# EAGLE schematic front-panel-revD-DEB-board1 (EAGLE 5.11), part 1 of 2
DRAWN_BY: Alexios; PROJECT_NAME: CFT Mini-Computer; REVISION: Rev A; SHEET_DESCRIPTION: Front Panel Light Connections; SIMULATION_FILENAME: N/A; URL: http://www.bedroomlan.org/cft

## Sheet 1 of 11
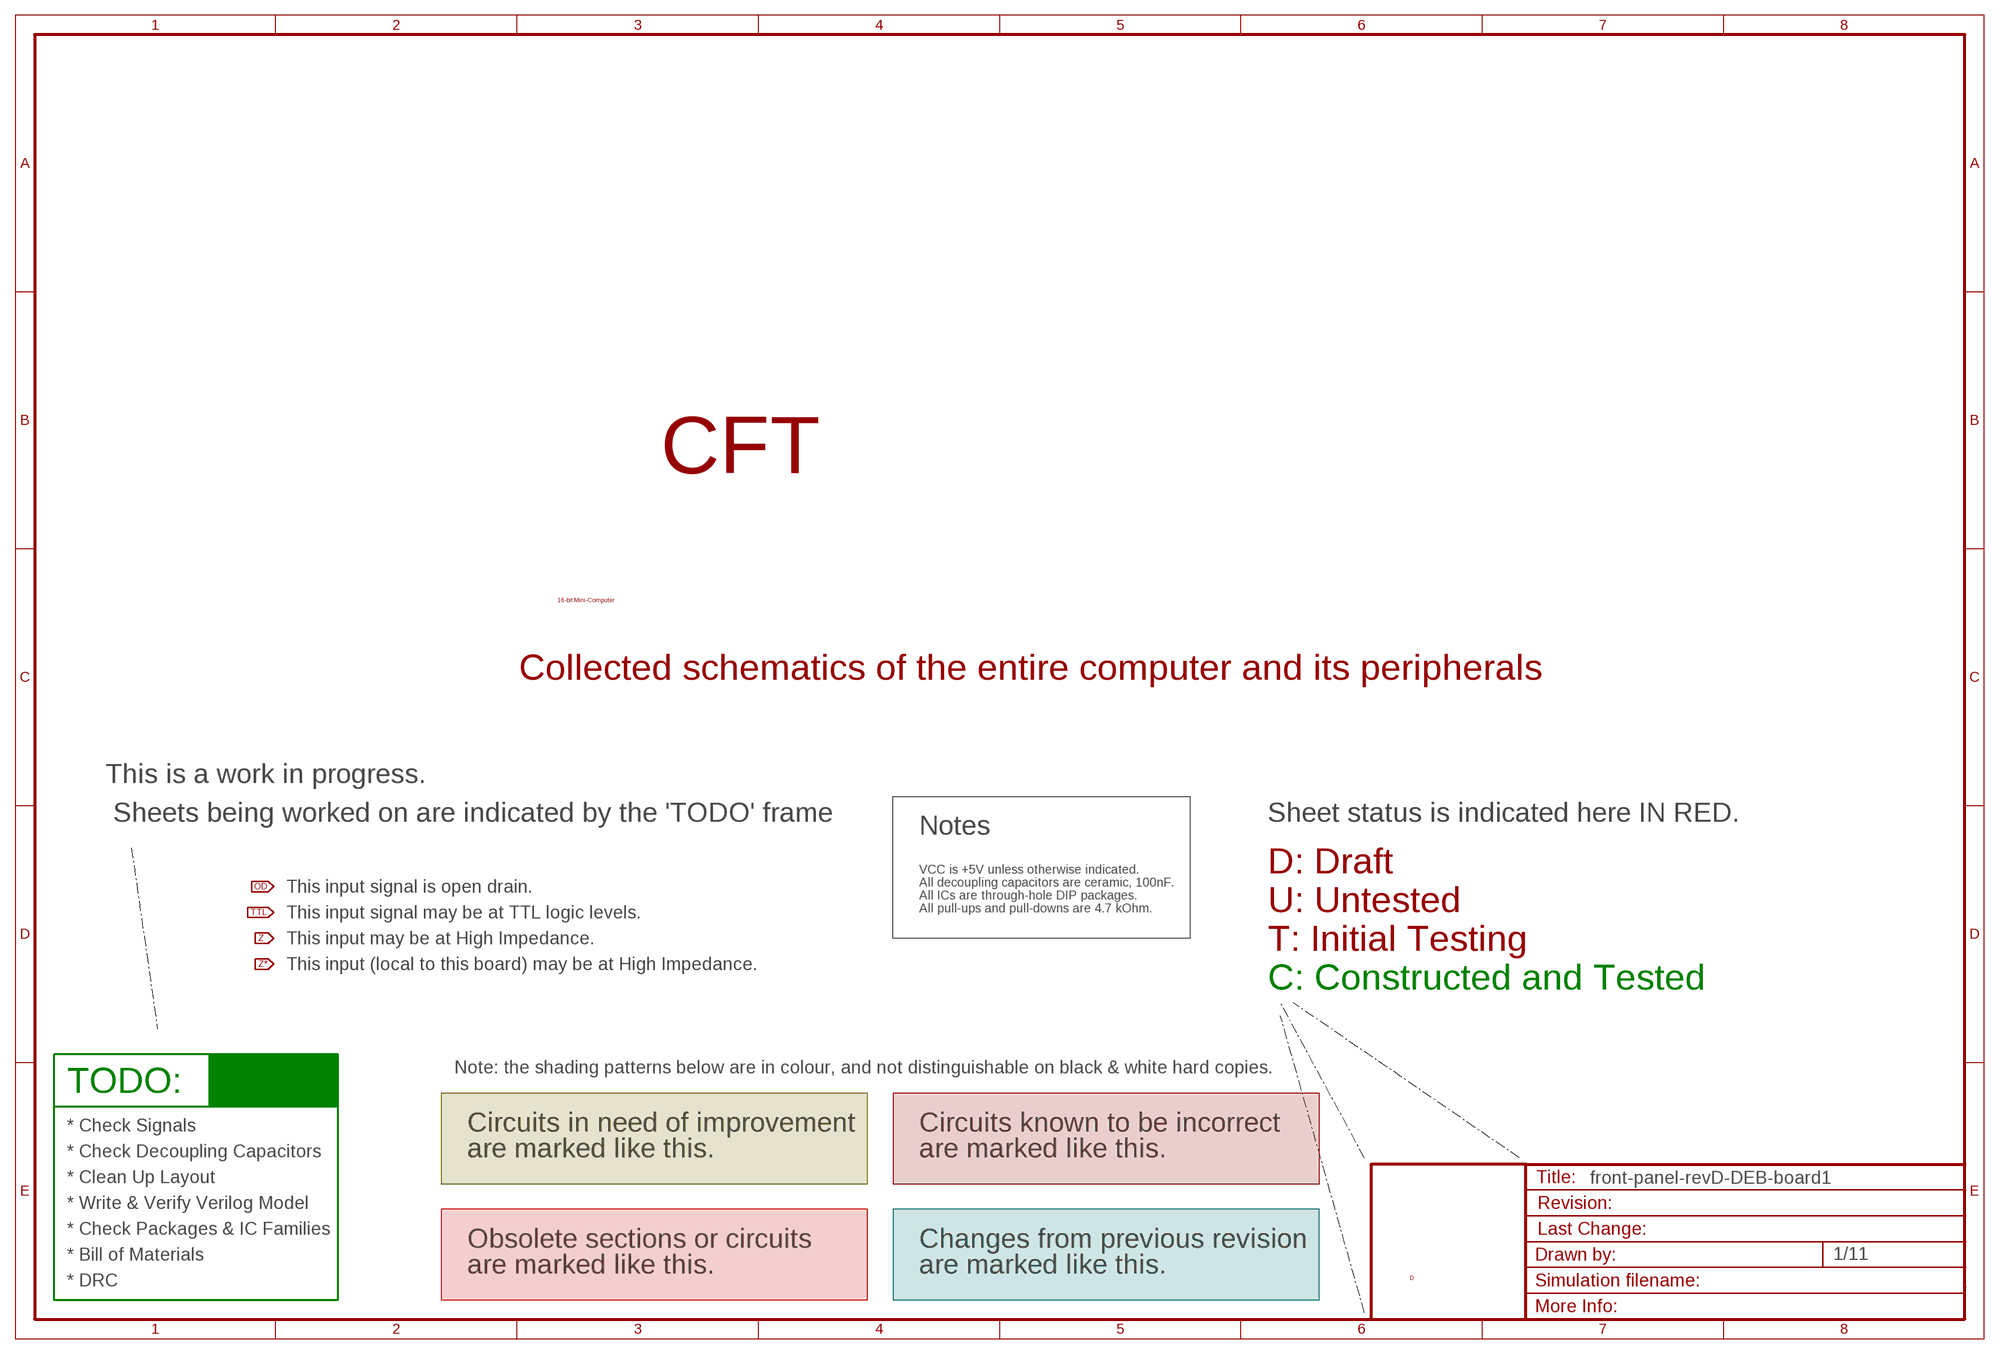
[diagram p0: schematic, sheet 1]

### Notes on the sheet
- CFT
- 16-bit Mini-Computer
- Collected schematics of the entire computer and its peripherals
- This is a work in progress.
- Sheets being worked on are indicated by the 'TODO' frame | Sheet status is indicated here IN RED.
- Notes
- VCC is +5V unless otherwise indicated. | D: Draft
- All decoupling capacitors are ceramic, 100nF.
- This input signal is open drain.
- All ICs are through-hole DIP packages.
- All pull-ups and pull-downs are 4.7 kOhm. | U: Untested
- This input signal may be at TTL logic levels.
- This input may be at High Impedance.
- T: Initial Testing
- This input (local to this board) may be at High Impedance.
- C: Constructed and Tested
- Note: the shading patterns below are in colour, and not distinguishable on black & white hard copies.
- TODO:
- * Check Signals | Circuits in need of improvement | Circuits known to be incorrect
- * Check Decoupling Capacitors | are marked like this. | are marked like this.
- * Clean Up Layout
- * Write & Verify Verilog Model
- * Check Packages & IC Families
- Obsolete sections or circuits | Changes from previous revision
- * Bill of Materials
- are marked like this. | are marked like this.
- D
- * DRC

## Sheet 2 of 11
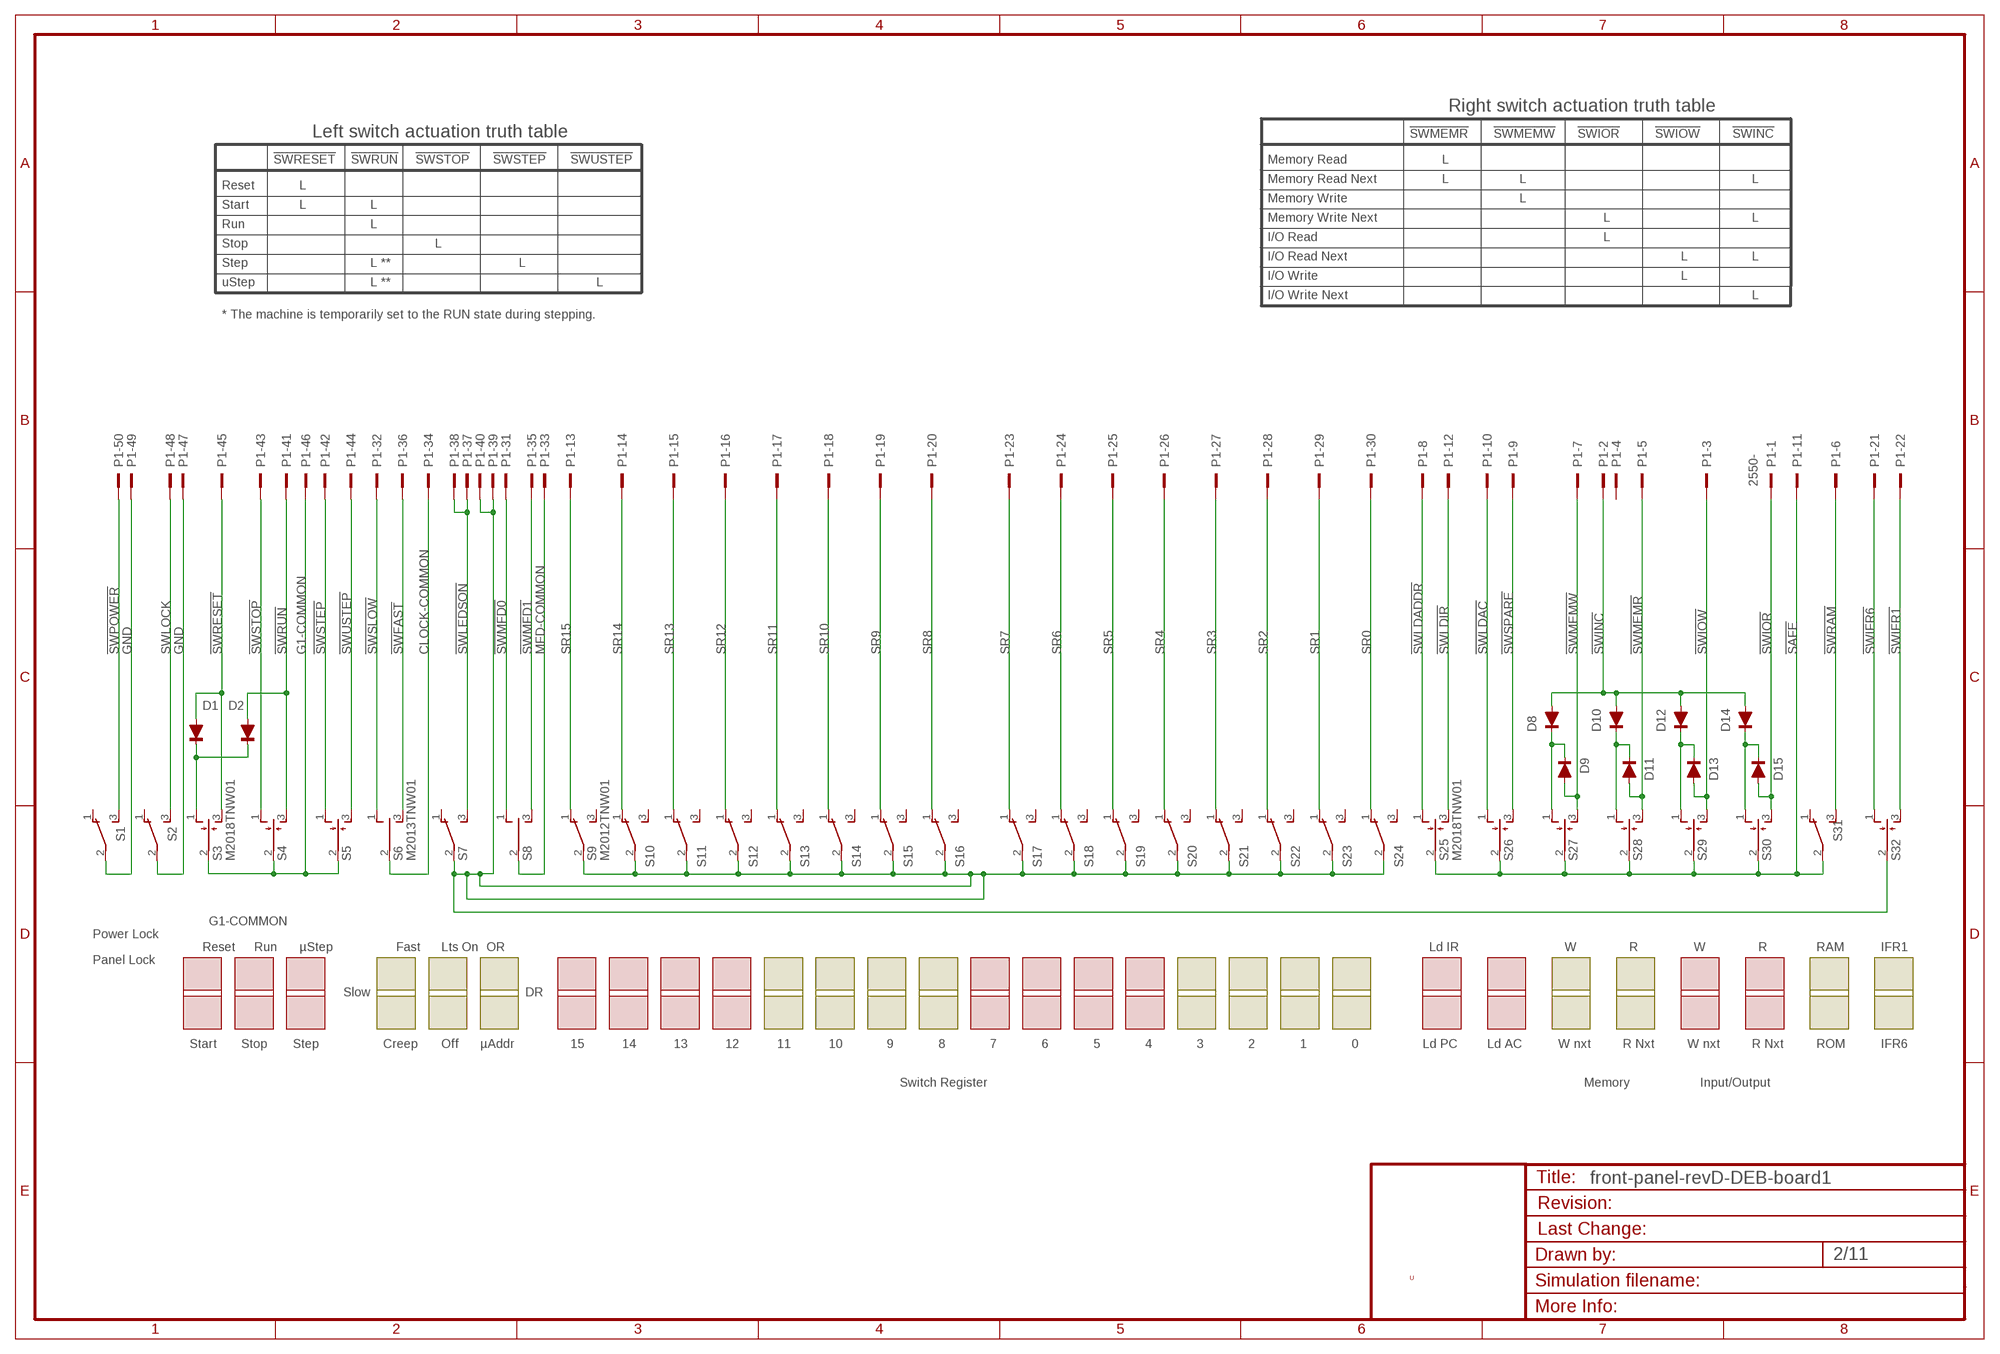
[diagram p1: schematic, sheet 2]

### Parts
D1  1N4148  1N4148DO35-7  [DO35-7]
D2  1N4148  1N4148DO35-7  [DO35-7]
D8  1N4148  1N4148DO35-7  [DO35-7]
D9  1N4148  1N4148DO35-7  [DO35-7]
D10  1N4148  1N4148DO35-7  [DO35-7]
D11  1N4148  1N4148DO35-7  [DO35-7]
D12  1N4148  1N4148DO35-7  [DO35-7]
D13  1N4148  1N4148DO35-7  [DO35-7]
D14  1N4148  1N4148DO35-7  [DO35-7]
D15  1N4148  1N4148DO35-7  [DO35-7]
P1  2550-  [PAK100/2500-50]
S1  TL36PO  [TL3XPO]
S2  TL36PO  [TL3XPO]
S3  M2018TNW01  TL37PO  [TL3XPO]
S4  TL37PO  [TL3XPO]
S5  TL37PO  [TL3XPO]
S6  M2013TNW01  TL39PO  [TL3XPO]
S7  TL36PO  [TL3XPO]
S8  TL39PO  [TL3XPO]
S9  M2012TNW01  TL36PO  [TL3XPO]
S10  TL36PO  [TL3XPO]
S11  TL36PO  [TL3XPO]
S12  TL36PO  [TL3XPO]
S13  TL36PO  [TL3XPO]
S14  TL36PO  [TL3XPO]
S15  TL36PO  [TL3XPO]
S16  TL36PO  [TL3XPO]
S17  TL36PO  [TL3XPO]
S18  TL36PO  [TL3XPO]
S19  TL36PO  [TL3XPO]
S20  TL36PO  [TL3XPO]
S21  TL36PO  [TL3XPO]
S22  TL36PO  [TL3XPO]
S23  TL36PO  [TL3XPO]
S24  TL36PO  [TL3XPO]
S25  M2018TNW01  TL37PO  [TL3XPO]
S26  TL37PO  [TL3XPO]
S27  TL37PO  [TL3XPO]
S28  TL37PO  [TL3XPO]
S29  TL37PO  [TL3XPO]
S30  TL37PO  [TL3XPO]
S31  TL36PO  [TL3XPO]
S32  TL37PO  [TL3XPO]

### Nets
!SAFE: P1.11 S25.2(P) S26.2(P) S27.2(P) S28.2(P) S29.2(P) S30.2(P) S31.2(P) ; also sheet 6
!SREN [low power]: P1.39 P1.40 S7.2(P) S9.2(P) S10.2(P) S11.2(P) S12.2(P) S13.2(P) S14.2(P) S15.2(P) S16.2(P) S17.2(P) S18.2(P) S19.2(P) S20.2(P) S21.2(P) S22.2(P) S23.2(P) S24.2(P) S32.2(P)
!SWFAST: P1.36 S6.3(S) ; also sheet 4,10
!SWIFR1: P1.22 S32.3(S) ; also sheet 4,10
!SWIFR6: P1.21 S32.1(O) ; also sheet 4,10
!SWINC: D8.A D10.A D12.A D14.A P1.2 ; also sheet 4,10
!SWIOR: D15.A P1.1 S30.3(S) ; also sheet 4,10
!SWIOW: D13.A P1.3 S29.3(S) ; also sheet 4,10
!SWLDAC: P1.10 S26.1(O) ; also sheet 4,10
!SWLDADDR: P1.8 S25.1(O) ; also sheet 4,10
!SWLDIR: P1.12 S25.3(S) ; also sheet 4,10
!SWLEDSON: P1.37 P1.38 S7.3(S) ; also sheet 9,10
!SWMEMR: D11.A P1.5 S28.3(S) ; also sheet 4,10
!SWMEMW: D9.A P1.7 S27.3(S) ; also sheet 4,10
!SWMFD0: P1.31 S8.1(O) ; also sheet 3,10
!SWMFD1: P1.35 S8.3(S) ; also sheet 3,10
!SWPOWER: P1.50 S1.3(S) ; also sheet 10
!SWRAM: P1.6 S31.3(S) ; also sheet 4,10
!SWRESET: D1.A P1.45 S3.3(S) ; also sheet 4,10
!SWRUN: D2.A P1.41 S4.3(S) ; also sheet 4,10
!SWSLOW: P1.32 S6.1(O) ; also sheet 4,10
!SWSPARE: P1.9 S26.3(S) ; also sheet 4,10
!SWSTEP: P1.42 S5.1(O) ; also sheet 4,10
!SWSTOP: P1.43 S4.1(O) ; also sheet 4,10
!SWUSTEP: P1.44 S5.3(S) ; also sheet 4,10
CLOCK-COMMON: P1.34 S6.2(P)
G1-COMMON: P1.46 S3.2(P) S4.2(P) S5.2(P)
GND [low power]: P1.47 P1.49 S1.2(P) S2.2(P) ; also sheet 3,4,5,6,7,8,9,10,11
MFD-COMMON [low power]: P1.33 S8.2(P)
N$64: D1.C D2.C S3.1(O)
N$84: D8.C D9.C S27.1(O)
N$88: D10.C D11.C S28.1(O)
N$90: D12.C D13.C S29.1(O)
N$92: D14.C D15.C S30.1(O)
SR0: P1.30 S24.1(O) ; also sheet 4,10
SR1: P1.29 S23.1(O) ; also sheet 4,10
SR2: P1.28 S22.1(O) ; also sheet 4,10
SR3: P1.27 S21.1(O) ; also sheet 4,10
SR4: P1.26 S20.1(O) ; also sheet 4,10
SR5: P1.25 S19.1(O) ; also sheet 4,10
SR6: P1.24 S18.1(O) ; also sheet 4,10
SR7: P1.23 S17.1(O) ; also sheet 4,10
SR8: P1.20 S16.1(O) ; also sheet 4,10
SR9: P1.19 S15.1(O) ; also sheet 4,10
SR10: P1.18 S14.1(O) ; also sheet 4,10
SR11: P1.17 S13.1(O) ; also sheet 4,10
SR12: P1.16 S12.1(O) ; also sheet 4,10
SR13: P1.15 S11.1(O) ; also sheet 4,10
SR14: P1.14 S10.1(O) ; also sheet 4,10
SR15: P1.13 S9.1(O) ; also sheet 4,10
SWLOCK: P1.48 S2.3(S) ; also sheet 4,10
Unconnected: P1.4 S1.1(O) S2.1(O) S7.1(O) S9.3(S) S10.3(S) S11.3(S) S12.3(S) S13.3(S) S14.3(S) S15.3(S) S16.3(S) S17.3(S) S18.3(S) S19.3(S) S20.3(S) S21.3(S) S22.3(S) S23.3(S) S24.3(S) S31.1(O)

### Notes on the sheet
- Right switch actuation truth table
- Left switch actuation truth table | !SWMEMR | !SWMEMW | !SWIOR | !SWIOW | !SWINC
- !SWRESET | !SWRUN | !SWSTOP | !SWSTEP | !SWUSTEP | Memory Read | L
- Memory Read Next | L | L | L
- Reset | L
- Memory Write | L
- Start | L | L
- Memory Write Next | L | L
- Run | L
- I/O Read | L
- Stop | L
- I/O Read Next | L | L
- Step | L ** | L
- I/O Write | L
- uStep | L ** | L
- I/O Write Next | L
- * The machine is temporarily set to the RUN state during stepping.
- Power Lock
- Reset | Run | µStep | Fast | Lts On | OR | Ld IR | W | R | W | R | RAM | IFR1
- Panel Lock
- Slow | DR
- Start | Stop | Step | Creep | Off | µAddr | 15 | 14 | 13 | 12 | 11 | 10 | 9 | 8 | 7 | 6 | 5 | 4 | 3 | 2 | 1 | 0 | Ld PC | Ld AC | W nxt | R Nxt | W nxt | R Nxt | ROM | IFR6
- Switch Register | Memory | Input/Output
- U

## Sheet 3 of 11
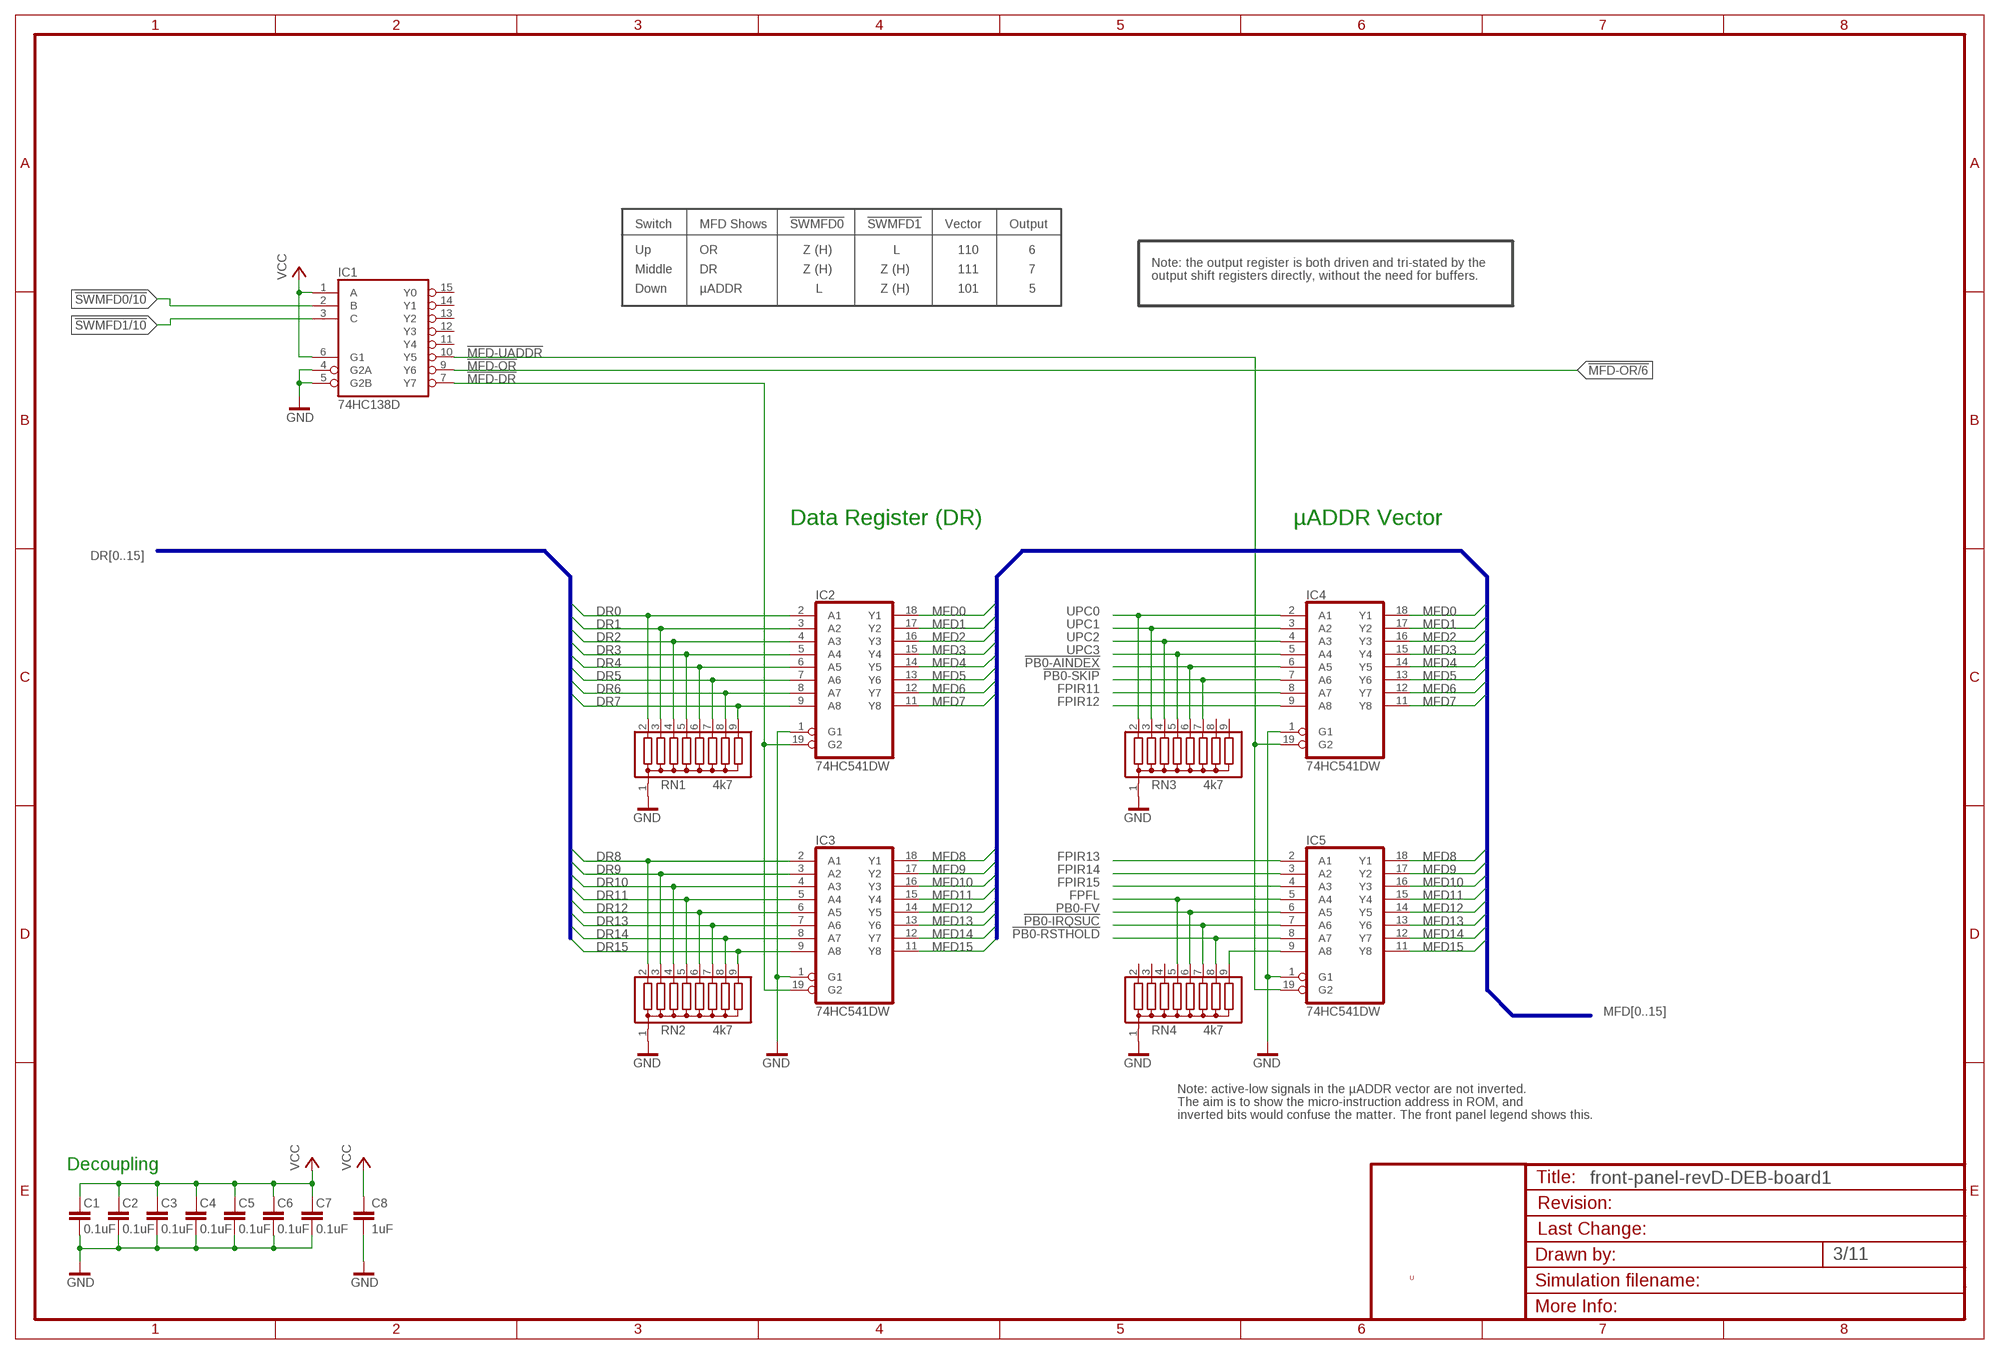
[diagram p2: schematic, sheet 3]

### Parts
C1  0.1uF  C-EU025-024X044  [C025-024X044]
C2  0.1uF  C-EU025-024X044  [C025-024X044]
C3  0.1uF  C-EU025-024X044  [C025-024X044]
C4  0.1uF  C-EU025-024X044  [C025-024X044]
C5  0.1uF  C-EU025-024X044  [C025-024X044]
C6  0.1uF  C-EU025-024X044  [C025-024X044]
C7  0.1uF  C-EU025-024X044  [C025-024X044]
C8  1uF  C-EU025-024X044  [C025-024X044]
IC1  74HC138D  [SO16]
IC2  74HC541DW  [SO20W]
IC3  74HC541DW  [SO20W]
IC4  74HC541DW  [SO20W]
IC5  74HC541DW  [SO20W]
RN1  4k7  G08R  [SIL9]
RN2  4k7  G08R  [SIL9]
RN3  4k7  G08R  [SIL9]
RN4  4k7  G08R  [SIL9]

### Nets
!MFD-DR: IC1.7(Y7) IC2.19(G2) IC3.19(G2)
!MFD-OR: IC1.9(Y6) ; also sheet 6
!MFD-UADDR: IC1.10(Y5) IC4.19(G2) IC5.19(G2)
!PB0-AINDEX: IC4.6(A5) RN3.6 ; also sheet 10
!PB0-IRQSUC: IC5.7(A6) RN4.7 ; also sheet 10
!PB0-RSTHOLD: IC5.8(A7) RN4.8 ; also sheet 10
!PB0-SKIP: IC4.7(A6) RN3.7 ; also sheet 10
!SWMFD0: IC1.2(B) ; also sheet 2,10
!SWMFD1: IC1.3(C) ; also sheet 2,10
DR0: IC2.2(A1) RN1.2 ; also sheet 10
DR1: IC2.3(A2) RN1.3 ; also sheet 10
DR2: IC2.4(A3) RN1.4 ; also sheet 10
DR3: IC2.5(A4) RN1.5 ; also sheet 10
DR4: IC2.6(A5) RN1.6 ; also sheet 10
DR5: IC2.7(A6) RN1.7 ; also sheet 10
DR6: IC2.8(A7) RN1.8 ; also sheet 10
DR7: IC2.9(A8) RN1.9 ; also sheet 10
DR8: IC3.2(A1) RN2.2 ; also sheet 10
DR9: IC3.3(A2) RN2.3 ; also sheet 10
DR10: IC3.4(A3) RN2.4 ; also sheet 10
DR11: IC3.5(A4) RN2.5 ; also sheet 10
DR12: IC3.6(A5) RN2.6 ; also sheet 10
DR13: IC3.7(A6) RN2.7 ; also sheet 10
DR14: IC3.8(A7) RN2.8 ; also sheet 10
DR15: IC3.9(A8) RN2.9 ; also sheet 10
FPFL: IC5.5(A4) RN4.5 ; also sheet 5,9,11
FPIR11: IC4.8(A7) ; also sheet 5,9,10
FPIR12: IC4.9(A8) ; also sheet 5,9,10
FPIR13: IC5.2(A1) ; also sheet 5,9,10
FPIR14: IC5.3(A2) ; also sheet 5,9,10
FPIR15: IC5.4(A3) ; also sheet 5,9,10
GND [low power]: C1.1 C2.1 C3.1 C4.1 C5.1 C6.1 C7.1 C8.2 IC1.4(G2A) IC1.5(G2B) IC2.1(G1) IC3.1(G1) IC4.1(G1) IC5.1(G1) RN1.1 RN2.1 RN3.1 RN4.1 ; also sheet 2,4,5,6,7,8,9,10,11
MFD0: IC2.18(Y1) IC4.18(Y1) ; also sheet 6,9
MFD1: IC2.17(Y2) IC4.17(Y2) ; also sheet 6,9
MFD2: IC2.16(Y3) IC4.16(Y3) ; also sheet 6,9
MFD3: IC2.15(Y4) IC4.15(Y4) ; also sheet 6,9
MFD4: IC2.14(Y5) IC4.14(Y5) ; also sheet 6,9
MFD5: IC2.13(Y6) IC4.13(Y6) ; also sheet 6,9
MFD6: IC2.12(Y7) IC4.12(Y7) ; also sheet 6,9
MFD7: IC2.11(Y8) IC4.11(Y8) ; also sheet 6,9
MFD8: IC3.18(Y1) IC5.18(Y1) ; also sheet 6,9
MFD9: IC3.17(Y2) IC5.17(Y2) ; also sheet 6,9
MFD10: IC3.16(Y3) IC5.16(Y3) ; also sheet 6,9
MFD11: IC3.15(Y4) IC5.15(Y4) ; also sheet 6,9
MFD12: IC3.14(Y5) IC5.14(Y5) ; also sheet 6,9
MFD13: IC3.13(Y6) IC5.13(Y6) ; also sheet 6,9
MFD14: IC3.12(Y7) IC5.12(Y7) ; also sheet 6,9
MFD15: IC3.11(Y8) IC5.11(Y8) ; also sheet 6,9
N$24 [low power]: IC5.9(A8) RN4.9
PB0-FV: IC5.6(A5) RN4.6 ; also sheet 5,9,10
UPC0: IC4.2(A1) RN3.2 ; also sheet 7,10
UPC1: IC4.3(A2) RN3.3 ; also sheet 7,10
UPC2: IC4.4(A3) RN3.4 ; also sheet 7,10
UPC3: IC4.5(A4) RN3.5 ; also sheet 7,10
VCC [low power]: C1.2 C2.2 C3.2 C4.2 C5.2 C6.2 C7.2 C8.1 IC1.1(A) IC1.6(G1) ; also sheet 4,5,6,7,8,10,11
Unconnected: IC1.11(Y4) IC1.12(Y3) IC1.13(Y2) IC1.14(Y1) IC1.15(Y0) RN3.8 RN3.9 RN4.2 RN4.3 RN4.4

### Buses
MFD[0..15]
DR[0..15]

### Notes on the sheet
- Switch | MFD Shows | !SWMFD0 | !SWMFD1 | Vector | Output
- Up | OR | Z (H) | L | 110 | 6
- Note: the output register is both driven and tri-stated by the
- Middle | DR | Z (H) | Z (H) | 111 | 7
- output shift registers directly, without the need for buffers.
- Down | µADDR | L | Z (H) | 101 | 5
- Data Register (DR) | µADDR Vector
- Note: active-low signals in the µADDR vector are not inverted.
- The aim is to show the micro-instruction address in ROM, and
- inverted bits would confuse the matter. The front panel legend shows this.
- Decoupling
- U

## Sheet 4 of 11
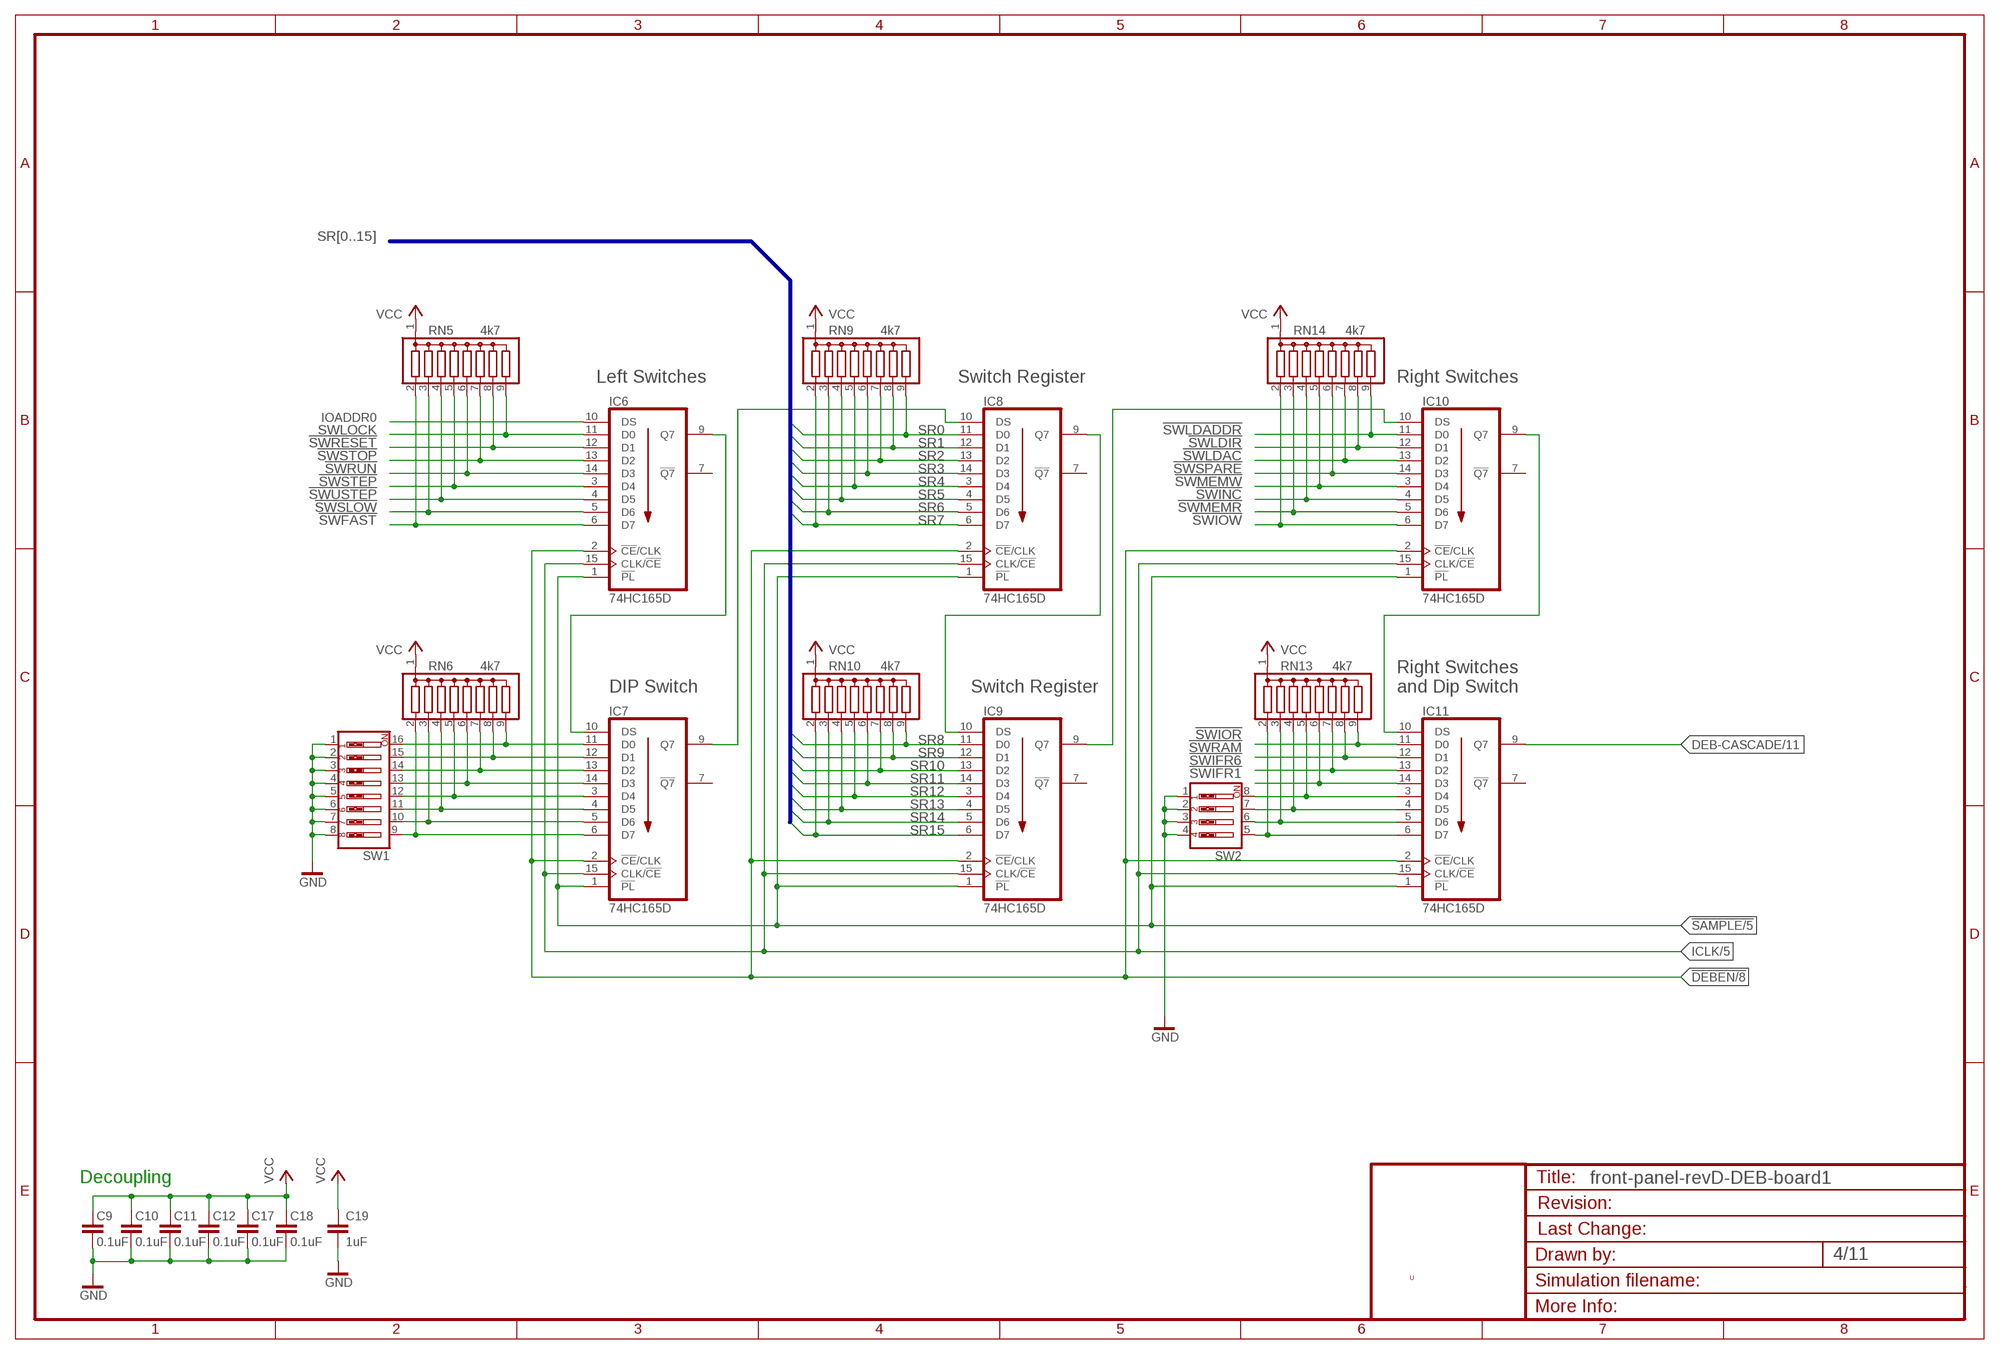
[diagram p3: schematic, sheet 4]

### Parts
C9  0.1uF  C-EU025-024X044  [C025-024X044]
C10  0.1uF  C-EU025-024X044  [C025-024X044]
C11  0.1uF  C-EU025-024X044  [C025-024X044]
C12  0.1uF  C-EU025-024X044  [C025-024X044]
C17  0.1uF  C-EU025-024X044  [C025-024X044]
C18  0.1uF  C-EU025-024X044  [C025-024X044]
C19  1uF  C-EU025-024X044  [C025-024X044]
IC6  74HC165D  [SO16]
IC7  74HC165D  [SO16]
IC8  74HC165D  [SO16]
IC9  74HC165D  [SO16]
IC10  74HC165D  [SO16]
IC11  74HC165D  [SO16]
RN5  4k7  G08R  [SIL9]
RN6  4k7  G08R  [SIL9]
RN9  4k7  G08R  [SIL9]
RN10  4k7  G08R  [SIL9]
RN13  4k7  G08R  [SIL9]
RN14  4k7  G08R  [SIL9]
SW1  SW_DIP-8  [EDG-08]
SW2  SW_DIP-4  [EDG-04]

### Nets
!DEBEN: IC6.2(!CE!/CLK) IC7.2(!CE!/CLK) IC8.2(!CE!/CLK) IC9.2(!CE!/CLK) IC10.2(!CE!/CLK) IC11.2(!CE!/CLK) ; also sheet 8,11
!SAMPLE: IC6.1(!PL) IC7.1(!PL) IC8.1(!PL) IC9.1(!PL) IC10.1(!PL) IC11.1(!PL) ; also sheet 5,8,11
!SWFAST: IC6.6(D7) RN5.2 ; also sheet 2,10
!SWIFR1: IC11.14(D3) RN13.6 ; also sheet 2,10
!SWIFR6: IC11.13(D2) RN13.7 ; also sheet 2,10
!SWINC: IC10.4(D5) RN14.4 ; also sheet 2,10
!SWIOR: IC11.11(D0) RN13.9 ; also sheet 2,10
!SWIOW: IC10.6(D7) RN14.2 ; also sheet 2,10
!SWLDAC: IC10.13(D2) RN14.7 ; also sheet 2,10
!SWLDADDR: IC10.11(D0) RN14.9 ; also sheet 2,10
!SWLDIR: IC10.12(D1) RN14.8 ; also sheet 2,10
!SWMEMR: IC10.5(D6) RN14.3 ; also sheet 2,10
!SWMEMW: IC10.3(D4) RN14.5 ; also sheet 2,10
!SWRAM: IC11.12(D1) RN13.8 ; also sheet 2,10
!SWRESET: IC6.12(D1) RN5.8 ; also sheet 2,10
!SWRUN: IC6.14(D3) RN5.6 ; also sheet 2,10
!SWSLOW: IC6.5(D6) RN5.3 ; also sheet 2,10
!SWSPARE: IC10.14(D3) RN14.6 ; also sheet 2,10
!SWSTEP: IC6.3(D4) RN5.5 ; also sheet 2,10
!SWSTOP: IC6.13(D2) RN5.7 ; also sheet 2,10
!SWUSTEP: IC6.4(D5) RN5.4 ; also sheet 2,10
DEB-CASCADE: IC11.9(Q7) ; also sheet 11
GND [low power]: C9.1 C10.1 C11.1 C12.1 C17.1 C18.1 C19.2 SW1.1 SW1.2 SW1.3 SW1.4 SW1.5 SW1.6 SW1.7 SW1.8 SW2.1 SW2.2 SW2.3 SW2.4 ; also sheet 2,3,5,6,7,8,9,10,11
ICLK: IC6.15(CLK/!CE!) IC7.15(CLK/!CE!) IC8.15(CLK/!CE!) IC9.15(CLK/!CE!) IC10.15(CLK/!CE!) IC11.15(CLK/!CE!) ; also sheet 5,8,11
IOADDR0: IC6.10(DS) ; also sheet 5,8,11
N$16: IC6.9(Q7) IC7.10(DS)
N$42: IC7.9(Q7) IC8.10(DS)
N$44: IC8.9(Q7) IC9.10(DS)
N$45: IC9.9(Q7) IC10.10(DS)
N$75: IC10.9(Q7) IC11.10(DS)
N$83: IC11.3(D4) RN13.5 SW2.8
N$86: IC11.4(D5) RN13.4 SW2.7
N$89: IC11.5(D6) RN13.3 SW2.6
N$91: IC11.6(D7) RN13.2 SW2.5
N$145: IC7.6(D7) RN6.2 SW1.9
N$146: IC7.5(D6) RN6.3 SW1.10
N$148: IC7.4(D5) RN6.4 SW1.11
N$149: IC7.3(D4) RN6.5 SW1.12
N$150: IC7.14(D3) RN6.6 SW1.13
N$151: IC7.13(D2) RN6.7 SW1.14
N$152: IC7.12(D1) RN6.8 SW1.15
N$153: IC7.11(D0) RN6.9 SW1.16
SR0: IC8.11(D0) RN9.9 ; also sheet 2,10
SR1: IC8.12(D1) RN9.8 ; also sheet 2,10
SR2: IC8.13(D2) RN9.7 ; also sheet 2,10
SR3: IC8.14(D3) RN9.6 ; also sheet 2,10
SR4: IC8.3(D4) RN9.5 ; also sheet 2,10
SR5: IC8.4(D5) RN9.4 ; also sheet 2,10
SR6: IC8.5(D6) RN9.3 ; also sheet 2,10
SR7: IC8.6(D7) RN9.2 ; also sheet 2,10
SR8: IC9.11(D0) RN10.9 ; also sheet 2,10
SR9: IC9.12(D1) RN10.8 ; also sheet 2,10
SR10: IC9.13(D2) RN10.7 ; also sheet 2,10
SR11: IC9.14(D3) RN10.6 ; also sheet 2,10
SR12: IC9.3(D4) RN10.5 ; also sheet 2,10
SR13: IC9.4(D5) RN10.4 ; also sheet 2,10
SR14: IC9.5(D6) RN10.3 ; also sheet 2,10
SR15: IC9.6(D7) RN10.2 ; also sheet 2,10
SWLOCK: IC6.11(D0) RN5.9 ; also sheet 2,10
VCC [low power]: C9.2 C10.2 C11.2 C12.2 C17.2 C18.2 C19.1 RN5.1 RN6.1 RN9.1 RN10.1 RN13.1 RN14.1 ; also sheet 3,5,6,7,8,10,11
Unconnected: IC6.7(!Q7) IC7.7(!Q7) IC8.7(!Q7) IC9.7(!Q7) IC10.7(!Q7) IC11.7(!Q7)

### Buses
SR[0..15]

### Notes on the sheet
- Left Switches | Switch Register | Right Switches
- Right Switches
- DIP Switch | Switch Register | and Dip Switch
- Decoupling
- U

## Sheet 5 of 11
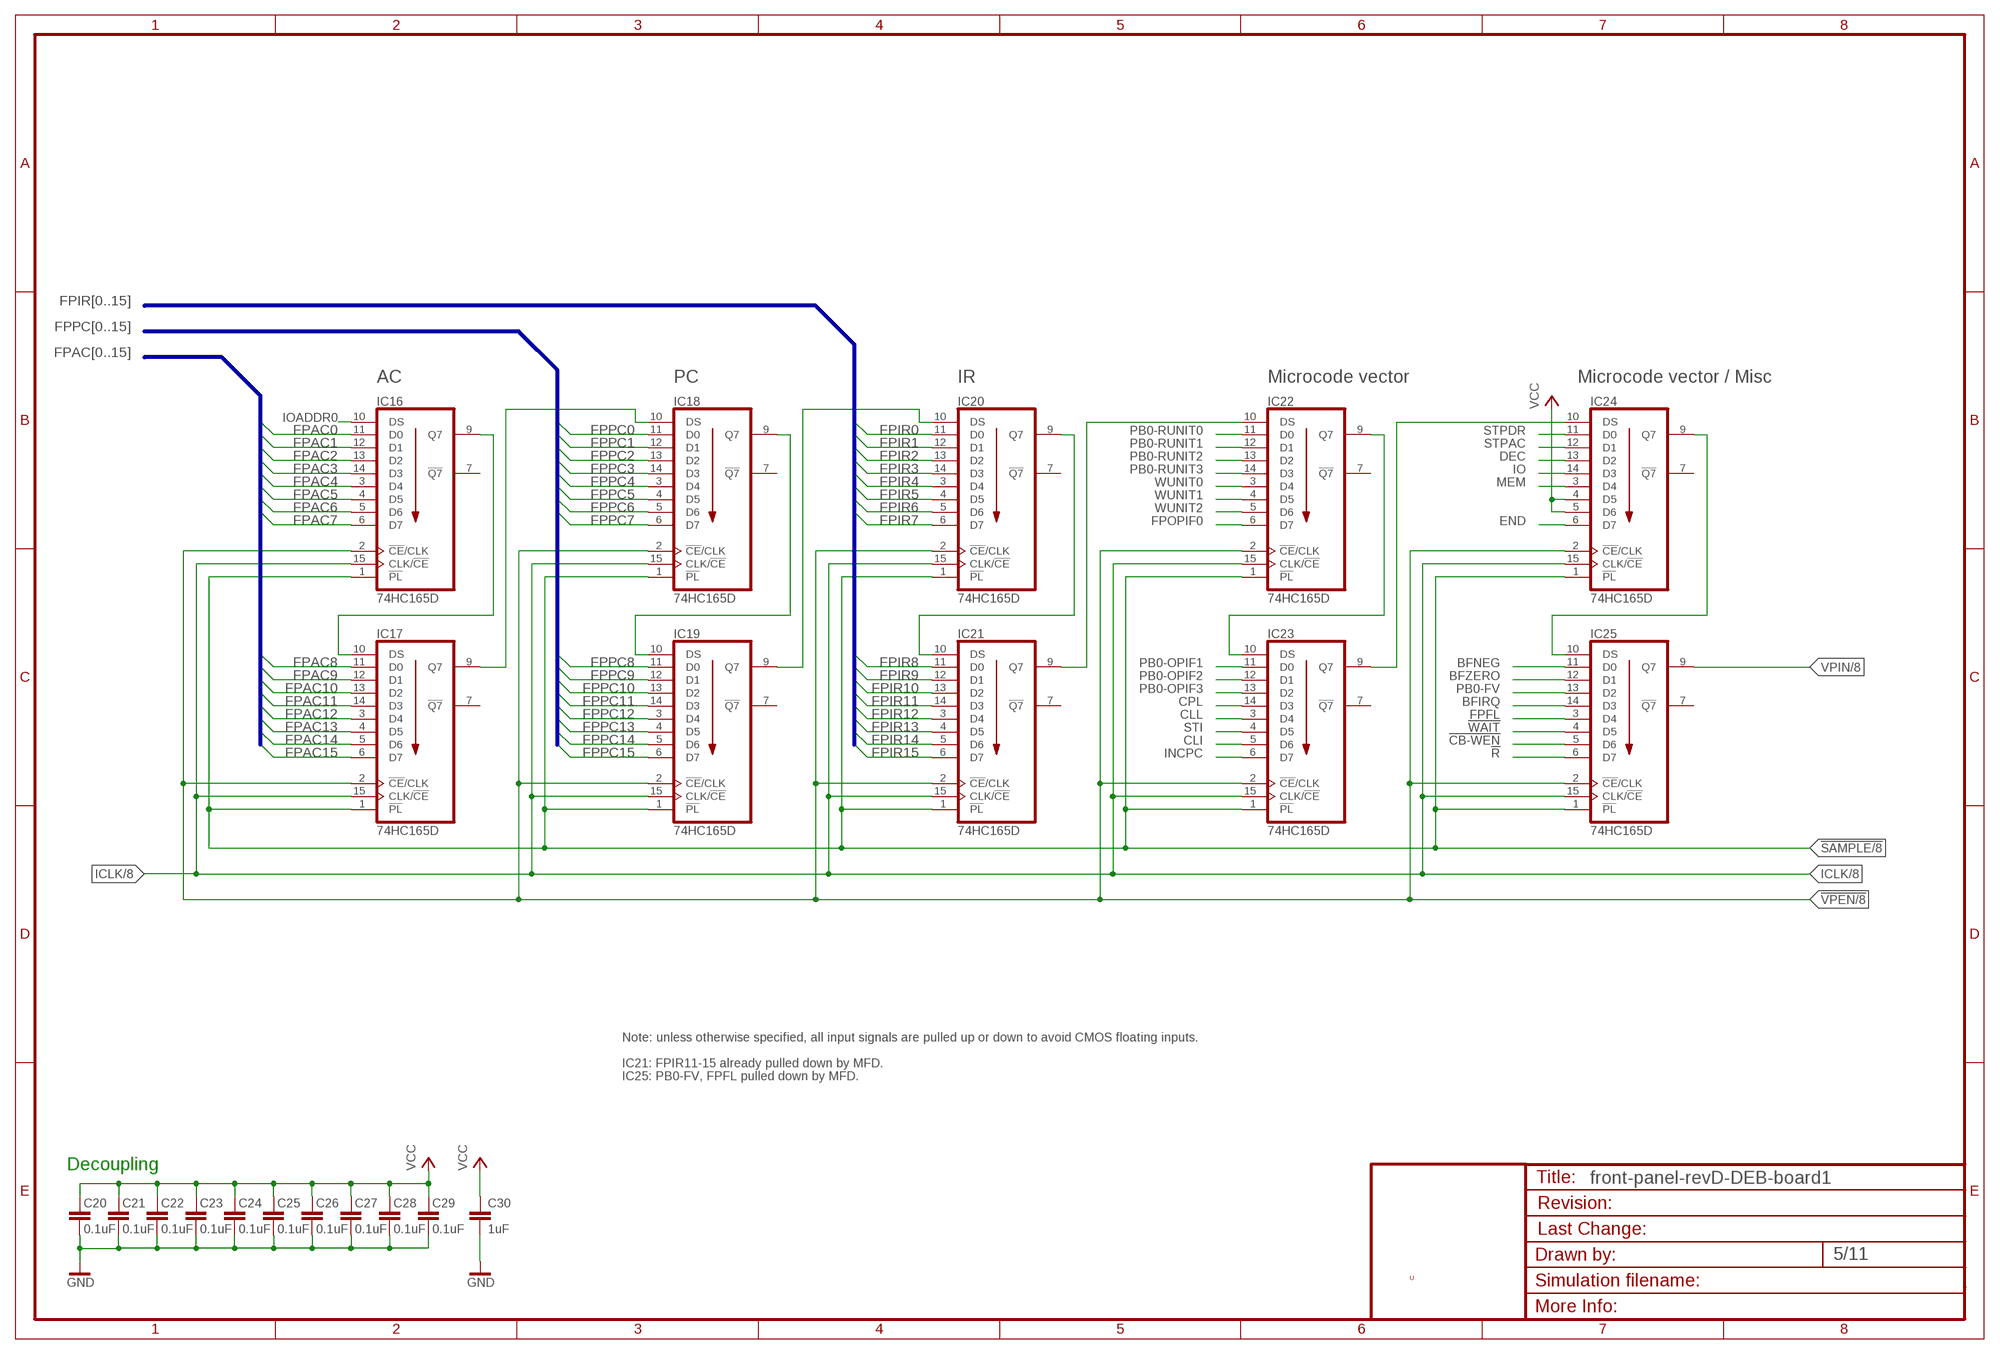
[diagram p4: schematic, sheet 5]

### Parts
C20  0.1uF  C-EU025-024X044  [C025-024X044]
C21  0.1uF  C-EU025-024X044  [C025-024X044]
C22  0.1uF  C-EU025-024X044  [C025-024X044]
C23  0.1uF  C-EU025-024X044  [C025-024X044]
C24  0.1uF  C-EU025-024X044  [C025-024X044]
C25  0.1uF  C-EU025-024X044  [C025-024X044]
C26  0.1uF  C-EU025-024X044  [C025-024X044]
C27  0.1uF  C-EU025-024X044  [C025-024X044]
C28  0.1uF  C-EU025-024X044  [C025-024X044]
C29  0.1uF  C-EU025-024X044  [C025-024X044]
C30  1uF  C-EU025-024X044  [C025-024X044]
IC16  74HC165D  [SO16]
IC17  74HC165D  [SO16]
IC18  74HC165D  [SO16]
IC19  74HC165D  [SO16]
IC20  74HC165D  [SO16]
IC21  74HC165D  [SO16]
IC22  74HC165D  [SO16]
IC23  74HC165D  [SO16]
IC24  74HC165D  [SO16]
IC25  74HC165D  [SO16]

### Nets
!CB-WEN: IC25.5(D6) ; also sheet 11
!R: IC25.6(D7) ; also sheet 6,11
!SAMPLE: IC16.1(!PL) IC17.1(!PL) IC18.1(!PL) IC19.1(!PL) IC20.1(!PL) IC21.1(!PL) IC22.1(!PL) IC23.1(!PL) IC24.1(!PL) IC25.1(!PL) ; also sheet 4,8,11
!VPEN: IC16.2(!CE!/CLK) IC17.2(!CE!/CLK) IC18.2(!CE!/CLK) IC19.2(!CE!/CLK) IC20.2(!CE!/CLK) IC21.2(!CE!/CLK) IC22.2(!CE!/CLK) IC23.2(!CE!/CLK) IC24.2(!CE!/CLK) IC25.2(!CE!/CLK) ; also sheet 8
!WAIT: IC25.4(D5) ; also sheet 7
BFIRQ: IC25.14(D3) ; also sheet 9,10
BFNEG: IC25.11(D0) ; also sheet 9,10
BFZERO: IC25.12(D1) ; also sheet 9,10
CLI: IC23.5(D6) ; also sheet 9,10
CLL: IC23.3(D4) ; also sheet 9,10
CPL: IC23.14(D3) ; also sheet 9,10
DEC: IC24.13(D2) ; also sheet 9,10
END: IC24.6(D7) ; also sheet 9,10
FPAC0: IC16.11(D0) ; also sheet 9,10
FPAC1: IC16.12(D1) ; also sheet 9,10
FPAC2: IC16.13(D2) ; also sheet 9,10
FPAC3: IC16.14(D3) ; also sheet 9,10
FPAC4: IC16.3(D4) ; also sheet 9,10
FPAC5: IC16.4(D5) ; also sheet 9,10
FPAC6: IC16.5(D6) ; also sheet 9,10
FPAC7: IC16.6(D7) ; also sheet 9,10
FPAC8: IC17.11(D0) ; also sheet 9,10
FPAC9: IC17.12(D1) ; also sheet 9,10
FPAC10: IC17.13(D2) ; also sheet 9,10
FPAC11: IC17.14(D3) ; also sheet 9,10
FPAC12: IC17.3(D4) ; also sheet 9,10
FPAC13: IC17.4(D5) ; also sheet 9,10
FPAC14: IC17.5(D6) ; also sheet 9,10
FPAC15: IC17.6(D7) ; also sheet 9,10
FPFL: IC25.3(D4) ; also sheet 3,9,11
FPIR0: IC20.11(D0) ; also sheet 9,10
FPIR1: IC20.12(D1) ; also sheet 9,10
FPIR2: IC20.13(D2) ; also sheet 9,10
FPIR3: IC20.14(D3) ; also sheet 9,10
FPIR4: IC20.3(D4) ; also sheet 9,10
FPIR5: IC20.4(D5) ; also sheet 9,10
FPIR6: IC20.5(D6) ; also sheet 9,10
FPIR7: IC20.6(D7) ; also sheet 9,10
FPIR8: IC21.11(D0) ; also sheet 9,10
FPIR9: IC21.12(D1) ; also sheet 9,10
FPIR10: IC21.13(D2) ; also sheet 9,10
FPIR11: IC21.14(D3) ; also sheet 3,9,10
FPIR12: IC21.3(D4) ; also sheet 3,9,10
FPIR13: IC21.4(D5) ; also sheet 3,9,10
FPIR14: IC21.5(D6) ; also sheet 3,9,10
FPIR15: IC21.6(D7) ; also sheet 3,9,10
FPOPIF0: IC22.6(D7) ; also sheet 9,11
FPPC0: IC18.11(D0) ; also sheet 9,10
FPPC1: IC18.12(D1) ; also sheet 9,10
FPPC2: IC18.13(D2) ; also sheet 9,10
FPPC3: IC18.14(D3) ; also sheet 9,10
FPPC4: IC18.3(D4) ; also sheet 9,10
FPPC5: IC18.4(D5) ; also sheet 9,10
FPPC6: IC18.5(D6) ; also sheet 9,10
FPPC7: IC18.6(D7) ; also sheet 9,10
FPPC8: IC19.11(D0) ; also sheet 9,10
FPPC9: IC19.12(D1) ; also sheet 9,10
FPPC10: IC19.13(D2) ; also sheet 9,10
FPPC11: IC19.14(D3) ; also sheet 9,10
FPPC12: IC19.3(D4) ; also sheet 9,10
FPPC13: IC19.4(D5) ; also sheet 9,10
FPPC14: IC19.5(D6) ; also sheet 9,10
FPPC15: IC19.6(D7) ; also sheet 9,10
GND [low power]: C20.1 C21.1 C22.1 C23.1 C24.1 C25.1 C26.1 C27.1 C28.1 C29.1 C30.2 ; also sheet 2,3,4,6,7,8,9,10,11
ICLK: IC16.15(CLK/!CE!) IC17.15(CLK/!CE!) IC18.15(CLK/!CE!) IC19.15(CLK/!CE!) IC20.15(CLK/!CE!) IC21.15(CLK/!CE!) IC22.15(CLK/!CE!) IC23.15(CLK/!CE!) IC24.15(CLK/!CE!) IC25.15(CLK/!CE!) ; also sheet 4,8,11
INCPC: IC23.6(D7) ; also sheet 9,10
IO: IC24.14(D3) ; also sheet 9,10
IOADDR0: IC16.10(DS) ; also sheet 4,8,11
MEM: IC24.3(D4) ; also sheet 9,10
N$116: IC16.9(Q7) IC17.10(DS)
N$117: IC17.9(Q7) IC18.10(DS)
N$119: IC18.9(Q7) IC19.10(DS)
N$120: IC19.9(Q7) IC20.10(DS)
N$121: IC20.9(Q7) IC21.10(DS)
N$122: IC21.9(Q7) IC22.10(DS)
N$123: IC22.9(Q7) IC23.10(DS)
N$124: IC23.9(Q7) IC24.10(DS)
N$125: IC24.9(Q7) IC25.10(DS)
PB0-FV: IC25.13(D2) ; also sheet 3,9,10
PB0-OPIF1: IC23.11(D0) ; also sheet 9,10
PB0-OPIF2: IC23.12(D1) ; also sheet 9,10
PB0-OPIF3: IC23.13(D2) ; also sheet 9,10
PB0-RUNIT0: IC22.11(D0) ; also sheet 9,10
PB0-RUNIT1: IC22.12(D1) ; also sheet 9,10
PB0-RUNIT2: IC22.13(D2) ; also sheet 9,10
PB0-RUNIT3: IC22.14(D3) ; also sheet 9,10
STI: IC23.4(D5) ; also sheet 9,10
STPAC: IC24.12(D1) ; also sheet 9,10
STPDR: IC24.11(D0) ; also sheet 9,10
VCC [low power]: C20.2 C21.2 C22.2 C23.2 C24.2 C25.2 C26.2 C27.2 C28.2 C29.2 C30.1 IC24.4(D5) IC24.5(D6) ; also sheet 3,4,6,7,8,10,11
VPIN: IC25.9(Q7) ; also sheet 8
WUNIT0: IC22.3(D4) ; also sheet 9,10
WUNIT1: IC22.4(D5) ; also sheet 9,10
WUNIT2: IC22.5(D6) ; also sheet 9,10
Unconnected: IC16.7(!Q7) IC17.7(!Q7) IC18.7(!Q7) IC19.7(!Q7) IC20.7(!Q7) IC21.7(!Q7) IC22.7(!Q7) IC23.7(!Q7) IC24.7(!Q7) IC25.7(!Q7)

### Buses
FPAC[0..15]
FPPC[0..15]
FPIR[0..15]

### Notes on the sheet
- AC | PC | IR | Microcode vector | Microcode vector / Misc
- Note: unless otherwise specified, all input signals are pulled up or down to avoid CMOS floating inputs.
- IC21: FPIR11-15 already pulled down by MFD.
- IC25: PB0-FV, FPFL pulled down by MFD.
- Decoupling
- U

## Sheet 6 of 11
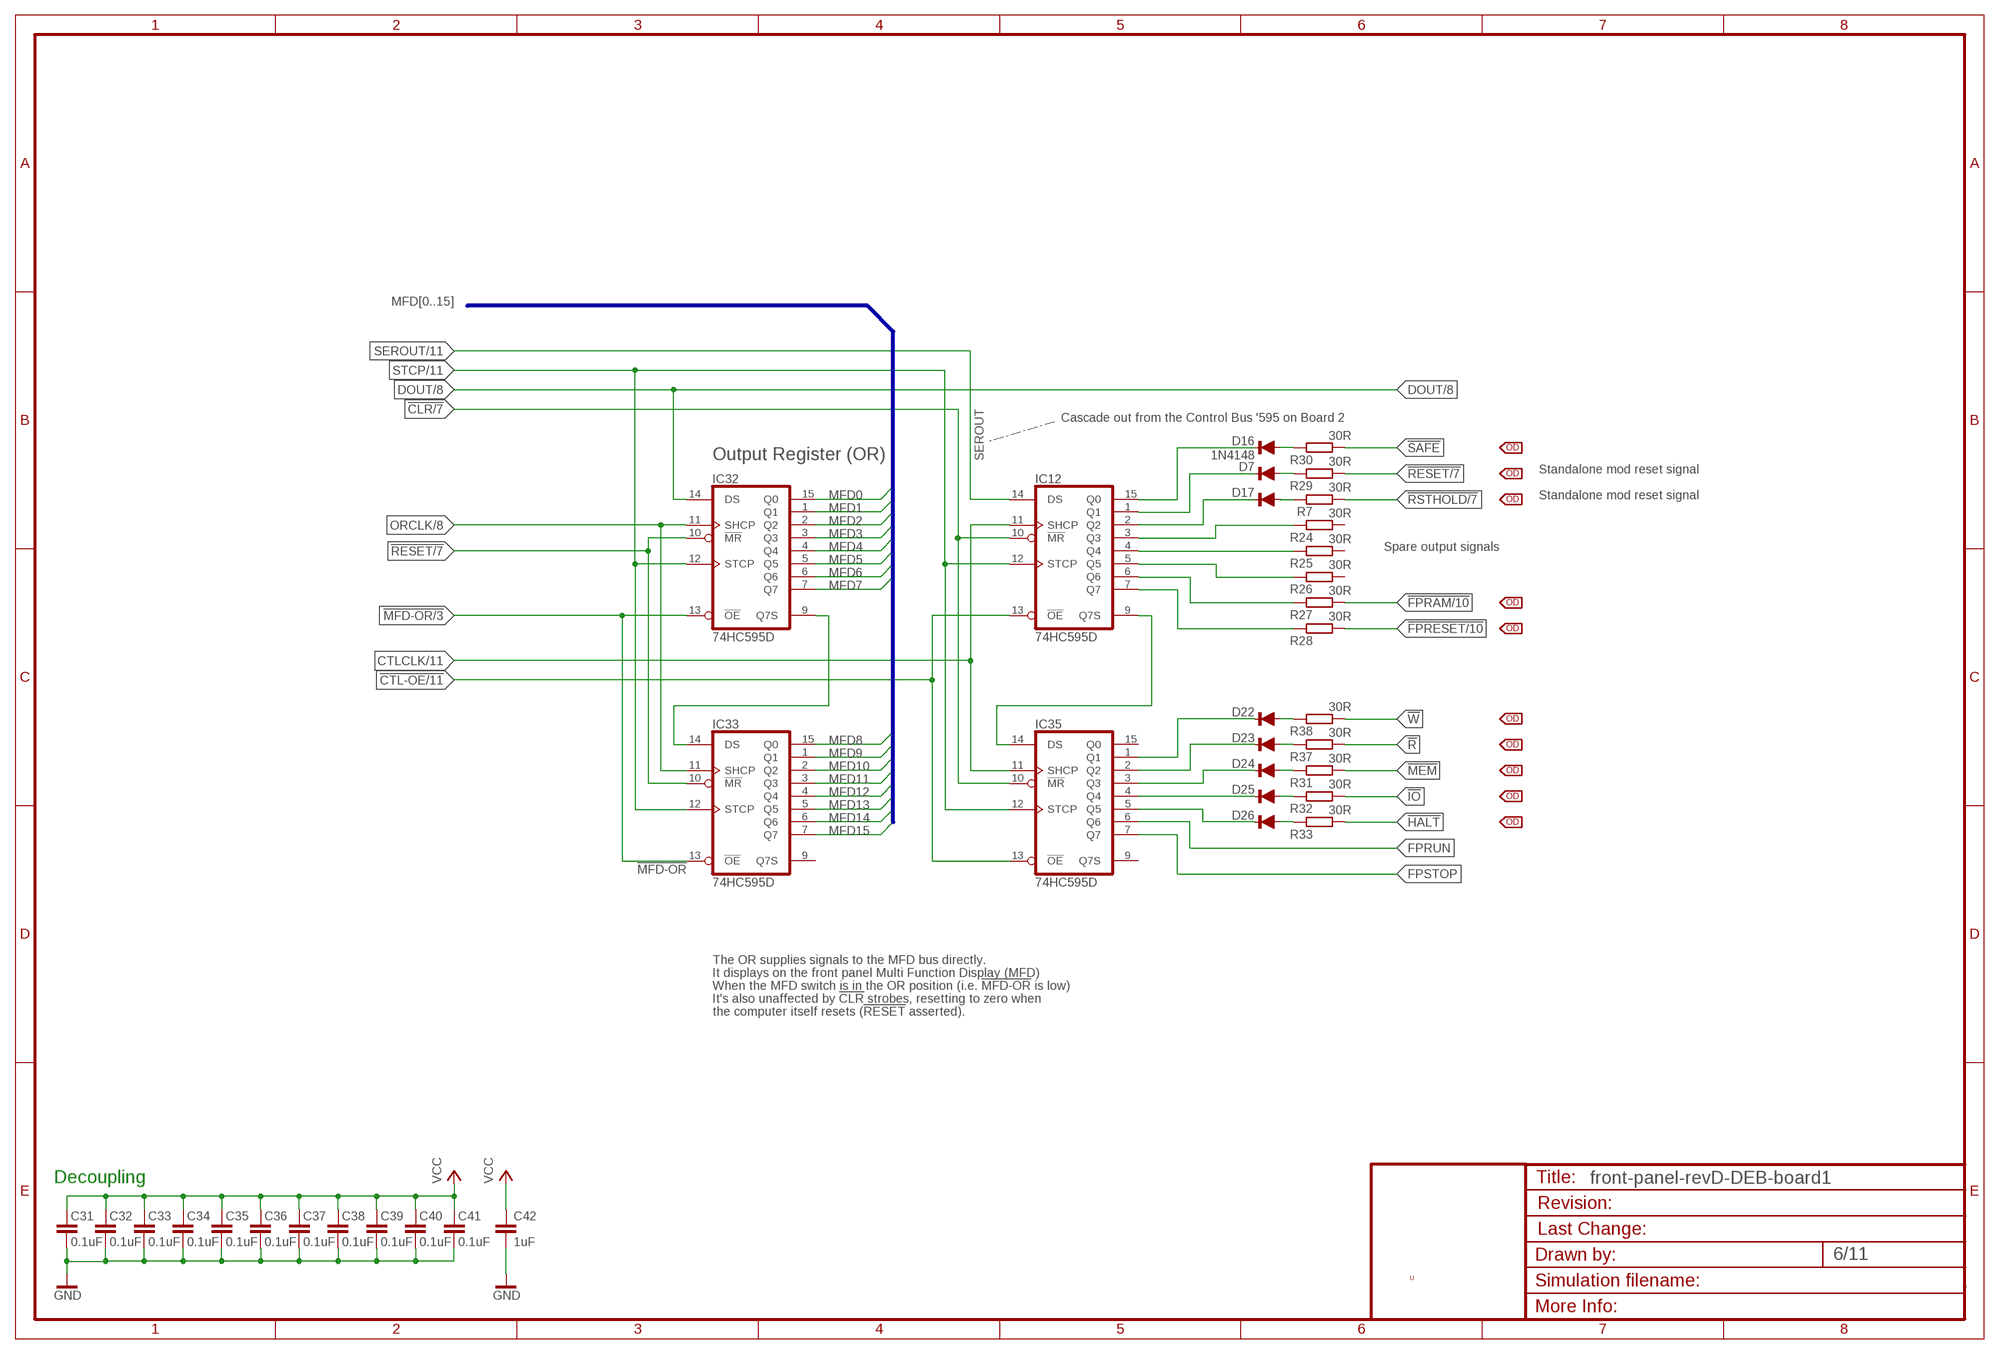
[diagram p5: schematic, sheet 6]

### Parts
C31  0.1uF  C-EU025-024X044  [C025-024X044]
C32  0.1uF  C-EU025-024X044  [C025-024X044]
C33  0.1uF  C-EU025-024X044  [C025-024X044]
C34  0.1uF  C-EU025-024X044  [C025-024X044]
C35  0.1uF  C-EU025-024X044  [C025-024X044]
C36  0.1uF  C-EU025-024X044  [C025-024X044]
C37  0.1uF  C-EU025-024X044  [C025-024X044]
C38  0.1uF  C-EU025-024X044  [C025-024X044]
C39  0.1uF  C-EU025-024X044  [C025-024X044]
C40  0.1uF  C-EU025-024X044  [C025-024X044]
C41  0.1uF  C-EU025-024X044  [C025-024X044]
C42  1uF  C-EU025-024X044  [C025-024X044]
D7  1N4148  1N4148DO35-7  [DO35-7]
D16  1N4148  1N4148DO35-7  [DO35-7]
D17  1N4148  1N4148DO35-7  [DO35-7]
D22  1N4148  1N4148DO35-7  [DO35-7]
D23  1N4148  1N4148DO35-7  [DO35-7]
D24  1N4148  1N4148DO35-7  [DO35-7]
D25  1N4148  1N4148DO35-7  [DO35-7]
D26  1N4148  1N4148DO35-7  [DO35-7]
IC12  74HC595D  [SO16]
IC32  74HC595D  [SO16]
IC33  74HC595D  [SO16]
IC35  74HC595D  [SO16]
R7  30R  R-EU_0204/7  [0204/7]
R24  30R  R-EU_0204/7  [0204/7]
R25  30R  R-EU_0204/7  [0204/7]
R26  30R  R-EU_0204/7  [0204/7]
R27  30R  R-EU_0204/7  [0204/7]
R28  30R  R-EU_0204/7  [0204/7]
R29  30R  R-EU_0204/7  [0204/7]
R30  30R  R-EU_0204/7  [0204/7]
R31  30R  R-EU_0204/7  [0204/7]
R32  30R  R-EU_0204/7  [0204/7]
R33  30R  R-EU_0204/7  [0204/7]
R37  30R  R-EU_0204/7  [0204/7]
R38  30R  R-EU_0204/7  [0204/7]

### Nets
!CLR: IC12.10(!MR) IC35.10(!MR) ; also sheet 7,8,11
!CTL-OE: IC12.13(!OE) IC35.13(!OE) ; also sheet 8,11
!FPRAM: R27.1 ; also sheet 10
!FPRESET: R28.1 ; also sheet 10
!HALT: R33.1 ; also sheet 11
!IO: R32.1 ; also sheet 11
!MEM: R31.1 ; also sheet 11
!MFD-OR: IC32.13(!OE) IC33.13(!OE) ; also sheet 3
!R: R37.1 ; also sheet 5,11
!RESET: IC32.10(!MR) IC33.10(!MR) R29.1 ; also sheet 7,11
!RSTHOLD: R7.1 ; also sheet 7,11
!SAFE: R30.1 ; also sheet 2
!W: R38.1 ; also sheet 11
CTLCLK: IC12.11(SHCP) IC35.11(SHCP) ; also sheet 11
DOUT: IC32.14(DS) ; also sheet 8,11
FPRUN: IC35.6(Q6) ; also sheet 9
FPSTOP: IC35.7(Q7) ; also sheet 9
GND [low power]: C31.1 C32.1 C33.1 C34.1 C35.1 C36.1 C37.1 C38.1 C39.1 C40.1 C41.1 C42.2 ; also sheet 2,3,4,5,7,8,9,10,11
MFD0: IC32.15(Q0) ; also sheet 3,9
MFD1: IC32.1(Q1) ; also sheet 3,9
MFD2: IC32.2(Q2) ; also sheet 3,9
MFD3: IC32.3(Q3) ; also sheet 3,9
MFD4: IC32.4(Q4) ; also sheet 3,9
MFD5: IC32.5(Q5) ; also sheet 3,9
MFD6: IC32.6(Q6) ; also sheet 3,9
MFD7: IC32.7(Q7) ; also sheet 3,9
MFD8: IC33.15(Q0) ; also sheet 3,9
MFD9: IC33.1(Q1) ; also sheet 3,9
MFD10: IC33.2(Q2) ; also sheet 3,9
MFD11: IC33.3(Q3) ; also sheet 3,9
MFD12: IC33.4(Q4) ; also sheet 3,9
MFD13: IC33.5(Q5) ; also sheet 3,9
MFD14: IC33.6(Q6) ; also sheet 3,9
MFD15: IC33.7(Q7) ; also sheet 3,9
N$10: D7.C IC12.1(Q1)
N$11: D7.A R29.2
N$12: D16.A R30.2
N$13: D17.C IC12.2(Q2)
N$14: D17.A R7.2
N$17: IC12.6(Q6) R27.2
N$18: IC12.7(Q7) R28.2
N$19: D26.A R33.2
N$20: D24.A R31.2
N$21: D25.A R32.2
N$22: D23.A R37.2
N$23: D22.A R38.2
N$27: IC12.3(Q3) R24.2
N$28: IC12.4(Q4) R25.2
N$29: IC12.5(Q5) R26.2
N$63: IC32.9(Q7S) IC33.14(DS)
N$115: IC12.9(Q7S) IC35.14(DS)
N$156: D16.C IC12.15(Q0)
N$175: D22.C IC35.1(Q1)
N$176: D23.C IC35.2(Q2)
N$177: D24.C IC35.3(Q3)
N$178: D25.C IC35.4(Q4)
N$179: D26.C IC35.5(Q5)
ORCLK: IC32.11(SHCP) IC33.11(SHCP) ; also sheet 8
SEROUT: IC12.14(DS) ; also sheet 11
STCP: IC12.12(STCP) IC32.12(STCP) IC33.12(STCP) IC35.12(STCP) ; also sheet 11
VCC [low power]: C31.2 C32.2 C33.2 C34.2 C35.2 C36.2 C37.2 C38.2 C39.2 C40.2 C41.2 C42.1 ; also sheet 3,4,5,7,8,10,11
Unconnected: IC33.9(Q7S) IC35.9(Q7S) IC35.15(Q0) R24.1 R25.1 R26.1

### Buses
MFD[0..15]

### Notes on the sheet
- Cascade out from the Control Bus '595 on Board 2
- Output Register (OR)
- Standalone mod reset signal
- Standalone mod reset signal
- Spare output signals
- The OR supplies signals to the MFD bus directly.
- It displays on the front panel Multi Function Display (MFD)
- When the MFD switch is in the OR position (i.e. !MFD-OR! is low)
- It's also unaffected by !CLR! strobes, resetting to zero when
- the computer itself resets (!RESET! asserted).
- Decoupling
- U

## Sheet 7 of 11
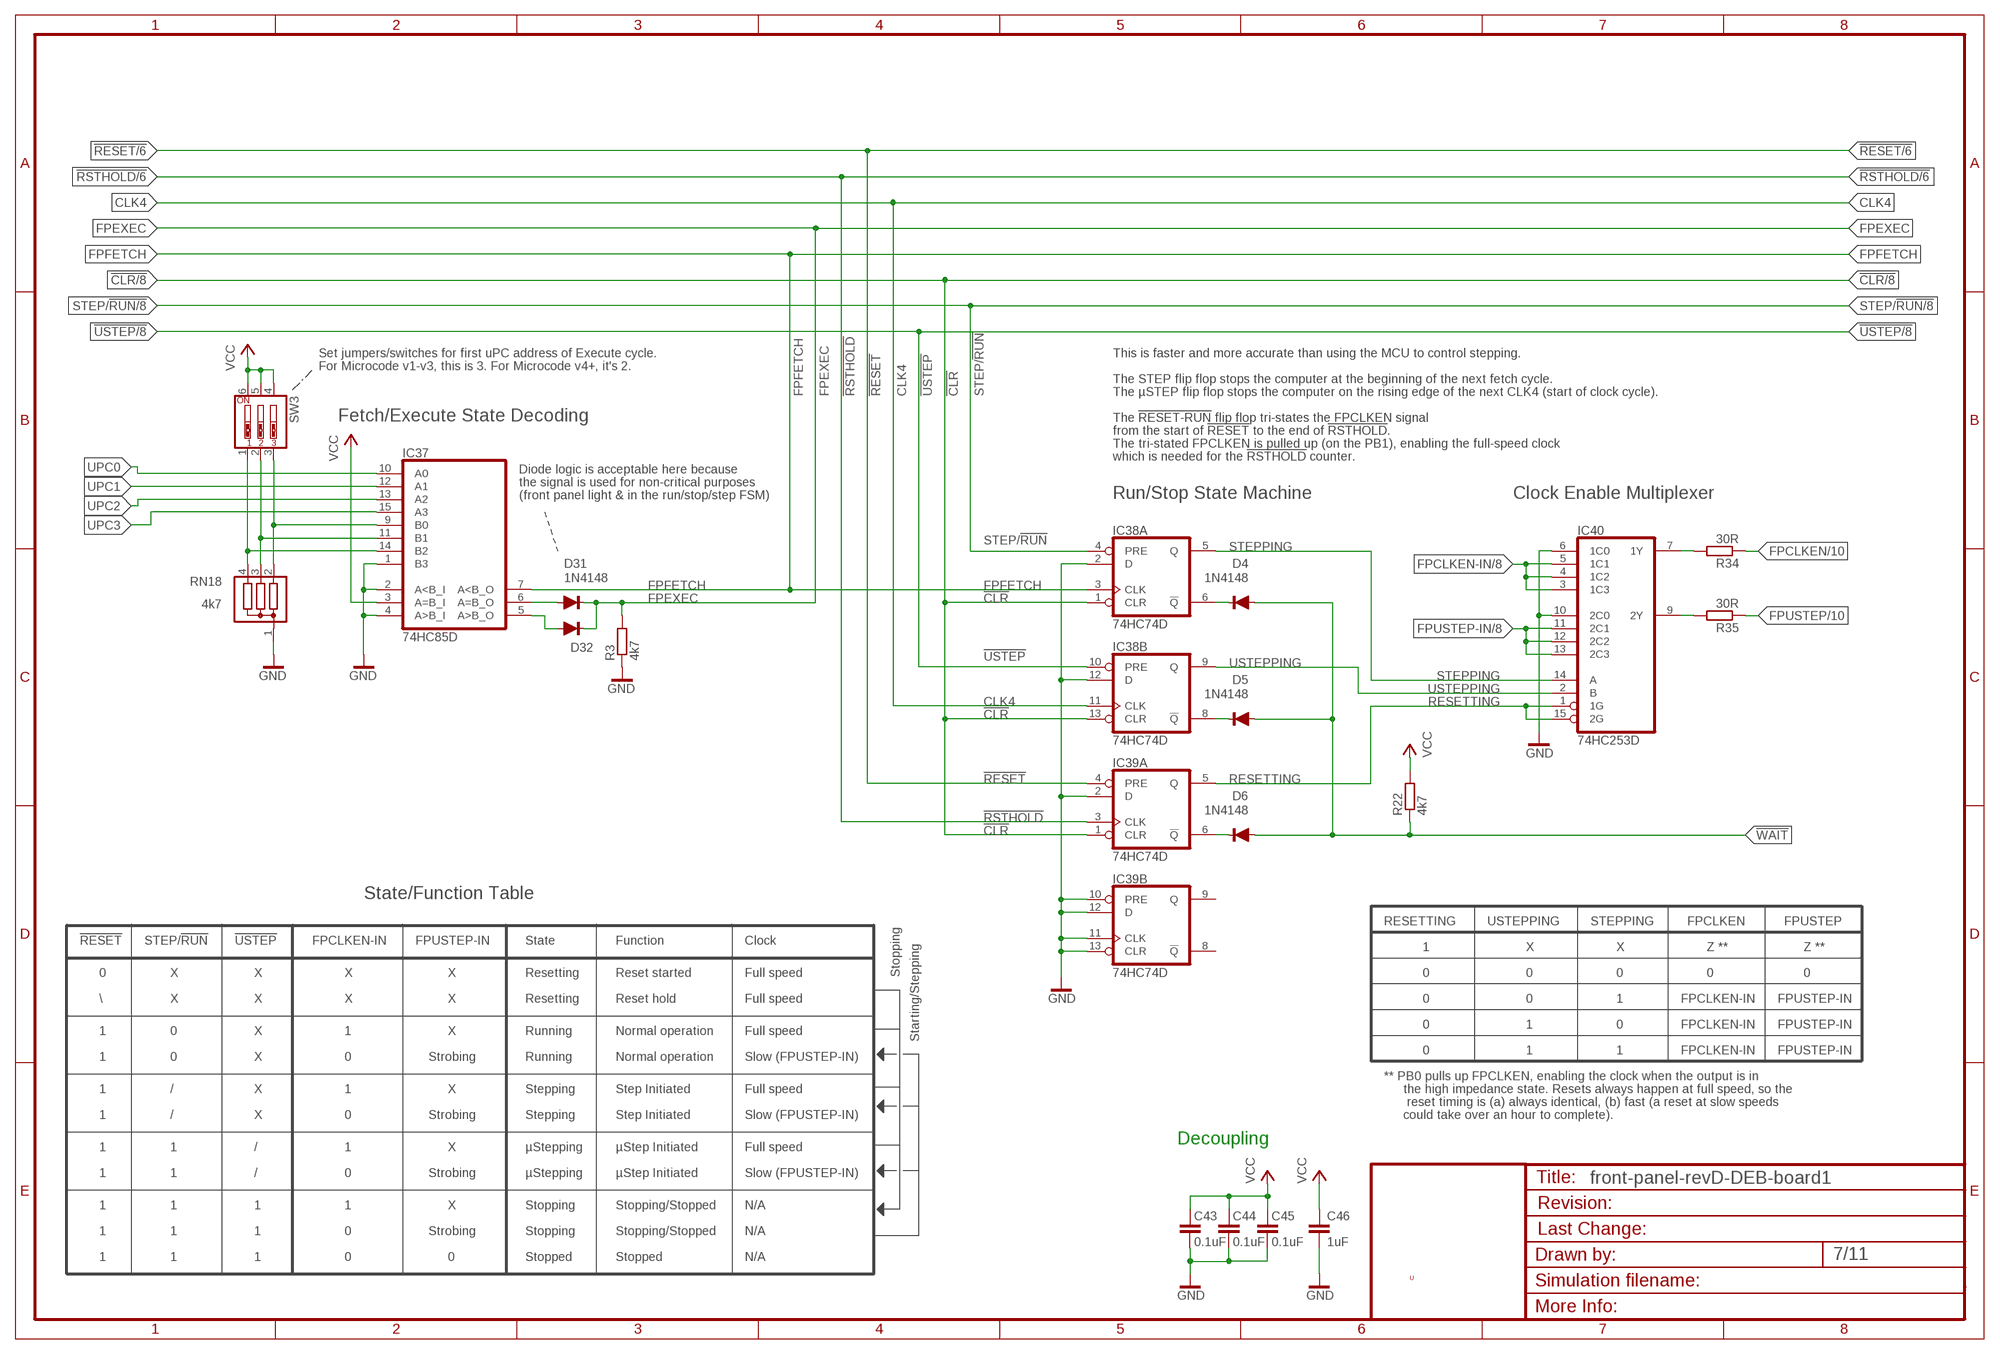
[diagram p6: schematic, sheet 7]

### Parts
C43  0.1uF  C-EU025-024X044  [C025-024X044]
C44  0.1uF  C-EU025-024X044  [C025-024X044]
C45  0.1uF  C-EU025-024X044  [C025-024X044]
C46  1uF  C-EU025-024X044  [C025-024X044]
D4  1N4148  1N4148DO35-7  [DO35-7]
D5  1N4148  1N4148DO35-7  [DO35-7]
D6  1N4148  1N4148DO35-7  [DO35-7]
D31  1N4148  1N4148DO35-7  [DO35-7]
D32  1N4148  1N4148DO35-7  [DO35-7]
IC37  74HC85D  [SO16]
IC38  74HC74D  [SO14]
IC39  74HC74D  [SO14]
IC40  74HC253D  [SO16]
R3  4k7  R-EU_0204/7  [0204/7]
R22  4k7  R-EU_0204/7  [0204/7]
R34  30R  R-EU_0204/7  [0204/7]
R35  30R  R-EU_0204/7  [0204/7]
RN18  4k7  G03R  [SIL4]
SW3  SW_DIP-3  [EDG-03]

### Nets
!CLR: IC38.1(A:CLR) IC38.13(B:CLR) IC39.1(A:CLR) ; also sheet 6,8,11
!RESET: IC39.4(A:PRE) ; also sheet 6,11
!RSTHOLD: IC39.3(A:CLK) ; also sheet 6,11
!USTEP: IC38.10(B:PRE) ; also sheet 8
!WAIT: D4.A D5.A D6.A R22.1 ; also sheet 5
CLK4: IC38.11(B:CLK) ; also sheet 11
FPCLKEN: R34.1 ; also sheet 10
FPCLKEN-IN: IC40.3(1C3) IC40.4(1C2) IC40.5(1C1) ; also sheet 8
FPEXEC: D31.C D32.C R3.2 ; also sheet 9
FPFETCH: IC37.7(A<B_O) IC38.3(A:CLK) ; also sheet 9
FPUSTEP: R35.1 ; also sheet 10
FPUSTEP-IN: IC40.11(2C1) IC40.12(2C2) IC40.13(2C3) ; also sheet 8
GND [low power]: C43.1 C44.1 C45.1 C46.2 IC37.1(B3) IC37.2(A<B_I) IC37.4(A>B_I) IC38.2(A:D) IC38.12(B:D) IC39.2(A:D) IC39.10(B:PRE) IC39.11(B:CLK) IC39.12(B:D) IC39.13(B:CLR) IC40.6(1C0) IC40.10(2C0) R3.1 RN18.1 ; also sheet 2,3,4,5,6,8,9,10,11
N$2: D4.C IC38.6(A:!Q)
N$3: D5.C IC38.8(B:!Q)
N$4: D6.C IC39.6(A:!Q)
N$25: IC40.9(2Y) R35.2
N$26: IC40.7(1Y) R34.2
N$102: IC37.9(B0) RN18.2 SW3.3
N$103: IC37.11(B1) RN18.3 SW3.2
N$104: IC37.14(B2) RN18.4 SW3.1
N$105: D32.A IC37.5(A>B_O)
N$106: D31.A IC37.6(A=B_O)
RESETTING: IC39.5(A:Q) IC40.1(1G) IC40.15(2G)
STEP/!RUN: IC38.4(A:PRE) ; also sheet 8
STEPPING: IC38.5(A:Q) IC40.14(A)
UPC0: IC37.10(A0) ; also sheet 3,10
UPC1: IC37.12(A1) ; also sheet 3,10
UPC2: IC37.13(A2) ; also sheet 3,10
UPC3: IC37.15(A3) ; also sheet 3,10
USTEPPING: IC38.9(B:Q) IC40.2(B)
VCC [low power]: C43.2 C44.2 C45.2 C46.1 IC37.3(A=B_I) R22.2 SW3.4 SW3.5 SW3.6 ; also sheet 3,4,5,6,8,10,11
Unconnected: IC39.8(B:!Q) IC39.9(B:Q)

### Notes on the sheet
- Set jumpers/switches for first uPC address of Execute cycle. | This is faster and more accurate than using the MCU to control stepping.
- For Microcode v1-v3, this is 3. For Microcode v4+, it's 2.
- The STEP flip flop stops the computer at the beginning of the next fetch cycle.
- The µSTEP flip flop stops the computer on the rising edge of the next CLK4 (start of clock cycle).
- Fetch/Execute State Decoding | The !RESET-RUN! flip flop tri-states the FPCLKEN signal
- from the start of !RESET! to the end of !RSTHOLD!.
- The tri-stated FPCLKEN is pulled up (on the PB1), enabling the full-speed clock
- which is needed for the !RSTHOLD! counter.
- Diode logic is acceptable here because
- the signal is used for non-critical purposes
- (front panel light & in the run/stop/step FSM) | Run/Stop State Machine | Clock Enable Multiplexer
- State/Function Table
- RESETTING | USTEPPING | STEPPING | FPCLKEN | FPUSTEP
- !RESET | STEP/!RUN | !USTEP | FPCLKEN-IN | FPUSTEP-IN | State | Function | Clock
- 1 | X | X | Z ** | Z **
- 0 | X | X | X | X | Resetting | Reset started | Full speed | Stopping | 0 | 0 | 0 | 0 | 0
- \ | X | X | X | X | Resetting | Reset hold | Full speed | 0 | 0 | 1 | FPCLKEN-IN | FPUSTEP-IN
- 0 | 1 | 0 | FPCLKEN-IN | FPUSTEP-IN
- 1 | 0 | X | 1 | X | Running | Normal operation | Full speed
- Starting/Stepping
- 0 | 1 | 1 | FPCLKEN-IN | FPUSTEP-IN
- 1 | 0 | X | 0 | Strobing | Running | Normal operation | Slow (FPUSTEP-IN)
- ** PB0 pulls up FPCLKEN, enabling the clock when the output is in
- 1 | / | X | 1 | X | Stepping | Step Initiated | Full speed | the high impedance state. Resets always happen at full speed, so the
- reset timing is (a) always identical, (b) fast (a reset at slow speeds
- 1 | / | X | 0 | Strobing | Stepping | Step Initiated | Slow (FPUSTEP-IN) | could take over an hour to complete).
- Decoupling
- 1 | 1 | / | 1 | X | µStepping | µStep Initiated | Full speed
- 1 | 1 | / | 0 | Strobing | µStepping | µStep Initiated | Slow (FPUSTEP-IN)
- 1 | 1 | 1 | 1 | X | Stopping | Stopping/Stopped | N/A
- 1 | 1 | 1 | 0 | Strobing | Stopping | Stopping/Stopped | N/A
- 1 | 1 | 1 | 0 | 0 | Stopped | Stopped | N/A
- U

## Sheet 8 of 11
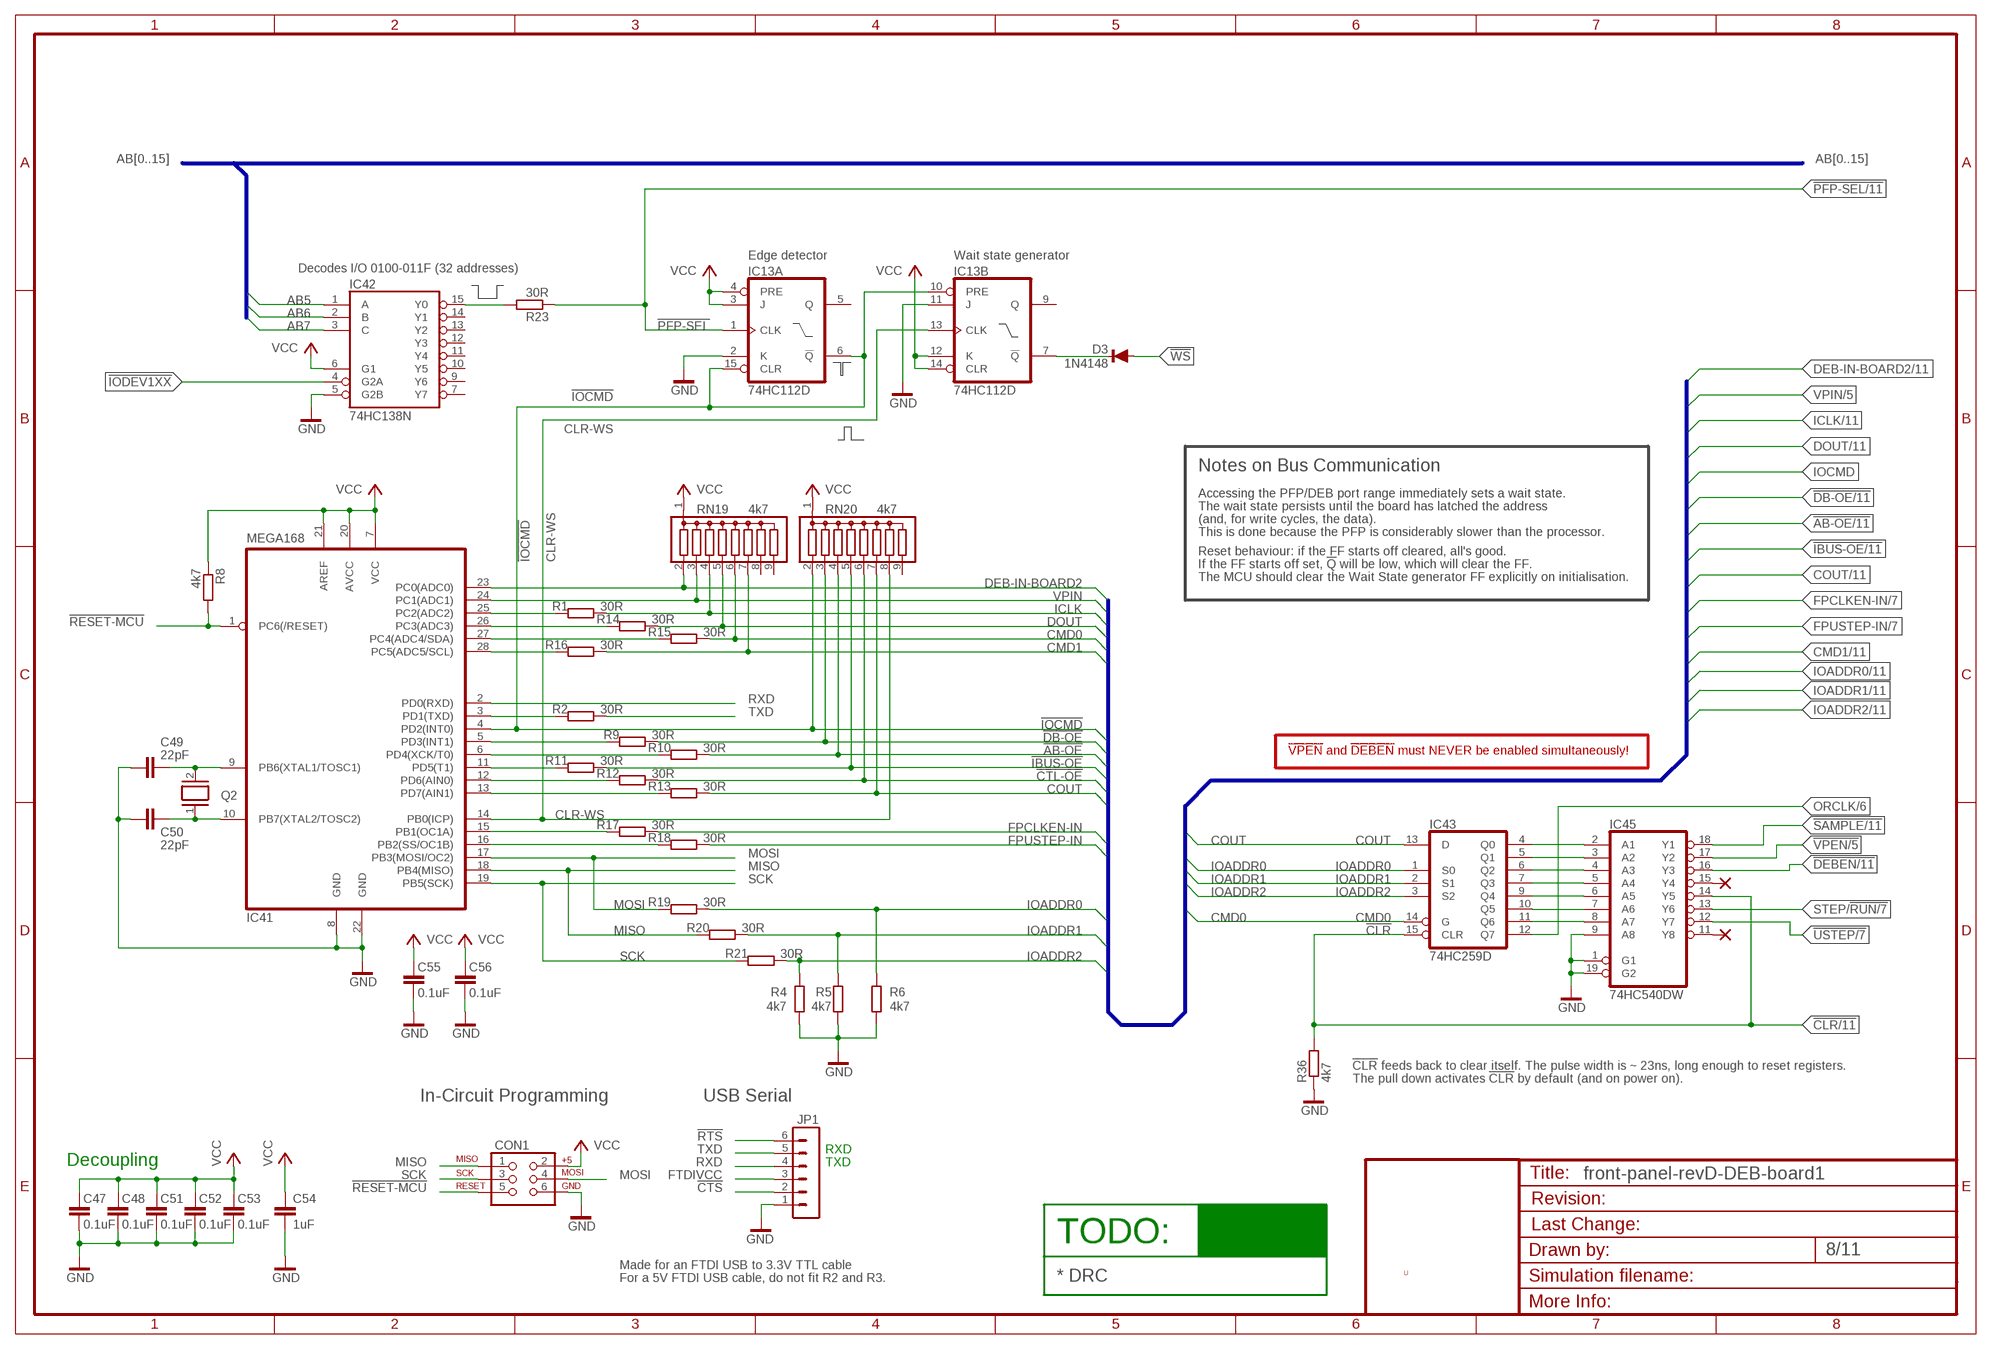
[diagram p7: schematic, sheet 8]

### Parts
C47  0.1uF  C-EU025-024X044  [C025-024X044]
C48  0.1uF  C-EU025-024X044  [C025-024X044]
C49  22pF  C-EU025-024X044  [C025-024X044]
C50  22pF  C-EU025-024X044  [C025-024X044]
C51  0.1uF  C-EU025-024X044  [C025-024X044]
C52  0.1uF  C-EU025-024X044  [C025-024X044]
C53  0.1uF  C-EU025-024X044  [C025-024X044]
C54  1uF  C-EU025-024X044  [C025-024X044]
C55  0.1uF  C-EU025-024X044  [C025-024X044]
C56  0.1uF  C-EU025-024X044  [C025-024X044]
CON1  AVR_SPI_PRG_6NS  [2X3-NS]
D3  1N4148  1N4148DO35-7  [DO35-7]
IC13  74HC112D  [SO16]
IC41  MEGA168  MEGA8-P  [DIL28-3]
IC42  74HC138N  [DIL16]
IC43  74HC259D  [SO16]
IC45  74HC540DW  [SO20W]
JP1  MA06-1  [MA06-1]
NC2  2,54/1,0  [2,54/1,0]
NC4  2,54/1,0  [2,54/1,0]
Q2  XTAL/S  [QS]
R1  30R  R-EU_0204/7  [0204/7]
R2  30R  R-EU_0204/7  [0204/7]
R4  4k7  R-EU_0204/7  [0204/7]
R5  4k7  R-EU_0204/7  [0204/7]
R6  4k7  R-EU_0204/7  [0204/7]
R8  4k7  R-EU_0204/7  [0204/7]
R9  30R  R-EU_0204/7  [0204/7]
R10  30R  R-EU_0204/7  [0204/7]
R11  30R  R-EU_0204/7  [0204/7]
R12  30R  R-EU_0204/7  [0204/7]
R13  30R  R-EU_0204/7  [0204/7]
R14  30R  R-EU_0204/7  [0204/7]
R15  30R  R-EU_0204/7  [0204/7]
R16  30R  R-EU_0204/7  [0204/7]
R17  30R  R-EU_0204/7  [0204/7]
R18  30R  R-EU_0204/7  [0204/7]
R19  30R  R-EU_0204/7  [0204/7]
R20  30R  R-EU_0204/7  [0204/7]
R21  30R  R-EU_0204/7  [0204/7]
R23  30R  R-EU_0204/7  [0204/7]
R36  4k7  R-EU_0204/7  [0204/7]
RN19  4k7  G08R  [SIL9]
RN20  4k7  G08R  [SIL9]

### Nets
!AB-OE: R10.1 RN20.4 ; also sheet 11
!CLR: IC43.15(CLR) IC45.14(Y5) R36.2 ; also sheet 6,7,11
!CTL-OE: R12.1 RN20.6 ; also sheet 6,11
!CTS: JP1.2
!DB-OE: R9.1 RN20.3 ; also sheet 11
!DEBEN: IC45.16(Y3) ; also sheet 4,11
!IBUS-OE: R11.1 RN20.5 ; also sheet 11
!IOCMD: IC13.6(A:!Q) IC13.10(B:PRE) IC13.15(A:CLR) IC41.4(PD2(INT0)) RN20.2
!IODEV1XX: IC42.4(G2A) ; also sheet 11
!PFP-SEL: IC13.1(A:CLK) R23.1 ; also sheet 11
!RESET-MCU: CON1.5 IC41.1(PC6(/RESET)) R8.2
!RTS: JP1.6
!SAMPLE: IC45.18(Y1) ; also sheet 4,5,11
!USTEP: IC45.12(Y7) ; also sheet 7
!VPEN: IC45.17(Y2) ; also sheet 5
!WS: D3.A ; also sheet 11
AB5: IC42.1(A) ; also sheet 11
AB6: IC42.2(B) ; also sheet 11
AB7: IC42.3(C) ; also sheet 11
CLR-WS: IC13.13(B:CLK) IC41.14(PB0(ICP)) RN20.8
CMD0: IC43.14(G) R15.1 RN19.6
CMD1: R16.1 RN19.7 ; also sheet 11
COUT: IC43.13(D) R13.1 RN20.7 ; also sheet 11
DEB-IN-BOARD2: IC41.23(PC0(ADC0)) RN19.2 ; also sheet 11
DOUT: R14.1 RN19.5 ; also sheet 6,11
FPCLKEN-IN: R17.1 ; also sheet 7
FPUSTEP-IN: R18.1 ; also sheet 7
FTDIVCC: JP1.3
GND [low power]: C47.1 C48.1 C49.2 C50.2 C51.1 C52.1 C53.1 C54.2 C55.1 C56.1 CON1.6 IC13.2(A:K) IC13.11(B:J) IC41.8(GND) IC41.22(GND) IC42.5(G2B) IC45.1(G1) IC45.9(A8) IC45.19(G2) JP1.1 R4.1 R5.1 R6.1 R36.1 ; also sheet 2,3,4,5,6,7,9,10,11
ICLK: R1.1 RN19.4 ; also sheet 4,5,11
IOADDR0: IC43.1(S0) R6.2 R19.1 ; also sheet 4,5,11
IOADDR1: IC43.2(S1) R5.2 R20.1 ; also sheet 11
IOADDR2: IC43.3(S2) R4.2 R21.1 ; also sheet 11
MISO: CON1.1 IC41.18(PB4(MISO)) R20.2
MOSI: CON1.4 IC41.17(PB3(MOSI/OC2)) R19.2
N$5: IC42.15(Y0) R23.2
N$6: IC43.10(Q5) IC45.7(A6)
N$8: D3.C IC13.7(B:!Q)
N$9: IC45.11(Y8) NC4.1(P)
N$15: IC43.11(Q6) IC45.8(A7)
N$30: IC45.15(Y4) NC2.1(P)
N$38: IC41.25(PC2(ADC2)) R1.2
N$39: IC41.3(PD1(TXD)) R2.2
N$40: C49.1 IC41.9(PB6(XTAL1/TOSC1)) Q2.2
N$41: C50.1 IC41.10(PB7(XTAL2/TOSC2)) Q2.1
N$43: IC41.5(PD3(INT1)) R9.2
N$65: IC41.6(PD4(XCK/T0)) R10.2
N$66: IC41.11(PD5(T1)) R11.2
N$67: IC41.12(PD6(AIN0)) R12.2
N$68: IC41.13(PD7(AIN1)) R13.2
N$69: IC41.26(PC3(ADC3)) R14.2
N$70: IC41.27(PC4(ADC4/SDA)) R15.2
N$72: IC41.28(PC5(ADC5/SCL)) R16.2
N$73: IC43.4(Q0) IC45.2(A1)
N$74: IC43.5(Q1) IC45.3(A2)
N$76: IC43.6(Q2) IC45.4(A3)
N$78: IC41.15(PB1(OC1A)) R17.2
N$79: IC43.7(Q3) IC45.5(A4)
N$80: IC43.9(Q4) IC45.6(A5)
N$81: IC41.16(PB2(SS/OC1B)) R18.2
ORCLK: IC43.12(Q7) ; also sheet 6
RXD: IC41.2(PD0(RXD)) JP1.4
SCK: CON1.3 IC41.19(PB5(SCK)) R21.2
STEP/!RUN: IC45.13(Y6) ; also sheet 7
TXD: JP1.5 R2.1
VCC [low power]: C47.2 C48.2 C51.2 C52.2 C53.2 C54.1 C55.2 C56.2 CON1.2 IC13.3(A:J) IC13.4(A:PRE) IC13.12(B:K) IC13.14(B:CLR) IC41.7(VCC) IC41.20(AVCC) IC41.21(AREF) IC42.6(G1) R8.1 RN19.1 RN20.1 ; also sheet 3,4,5,6,7,10,11
VPIN: IC41.24(PC1(ADC1)) RN19.3 ; also sheet 5
Unconnected: IC13.5(A:Q) IC13.9(B:Q) IC42.7(Y7) IC42.9(Y6) IC42.10(Y5) IC42.11(Y4) IC42.12(Y3) IC42.13(Y2) IC42.14(Y1) RN19.8 RN19.9 RN20.9

### Buses
AB[0..15]
DEB-IN-BOARD2,VPIN,ICLK,DOUT,CMD[0..1],IOCMD,!DB-OE,!AB-OE,!IBUS-OE,!CTL-OE,COUT,FPCLKEN-IN,FPUSTEP-IN,IOADDR[0..2]

### Notes on the sheet
- Edge detector | Wait state generator
- Decodes I/O 0100-011F (32 addresses)
- Notes on Bus Communication
- Accessing the PFP/DEB port range immediately sets a wait state.
- The wait state persists until the board has latched the address
- (and, for write cycles, the data).
- This is done because the PFP is considerably slower than the processor.
- Reset behaviour: if the FF starts off cleared, all's good.
- If the FF starts off set, !Q! will be low, which will clear the FF.
- The MCU should clear the Wait State generator FF explicitly on initialisation.
- !VPEN! and !DEBEN! must NEVER be enabled simultaneously!
- !CLR! feeds back to clear itself. The pulse width is ~ 23ns, long enough to reset registers.
- The pull down activates !CLR! by default (and on power on).
- In-Circuit Programming | USB Serial
- RXD
- Decoupling | TXD
- TODO:
- Made for an FTDI USB to 3.3V TTL cable
- U
- For a 5V FTDI USB cable, do not fit R2 and R3. | * DRC

## Sheet 9 of 11
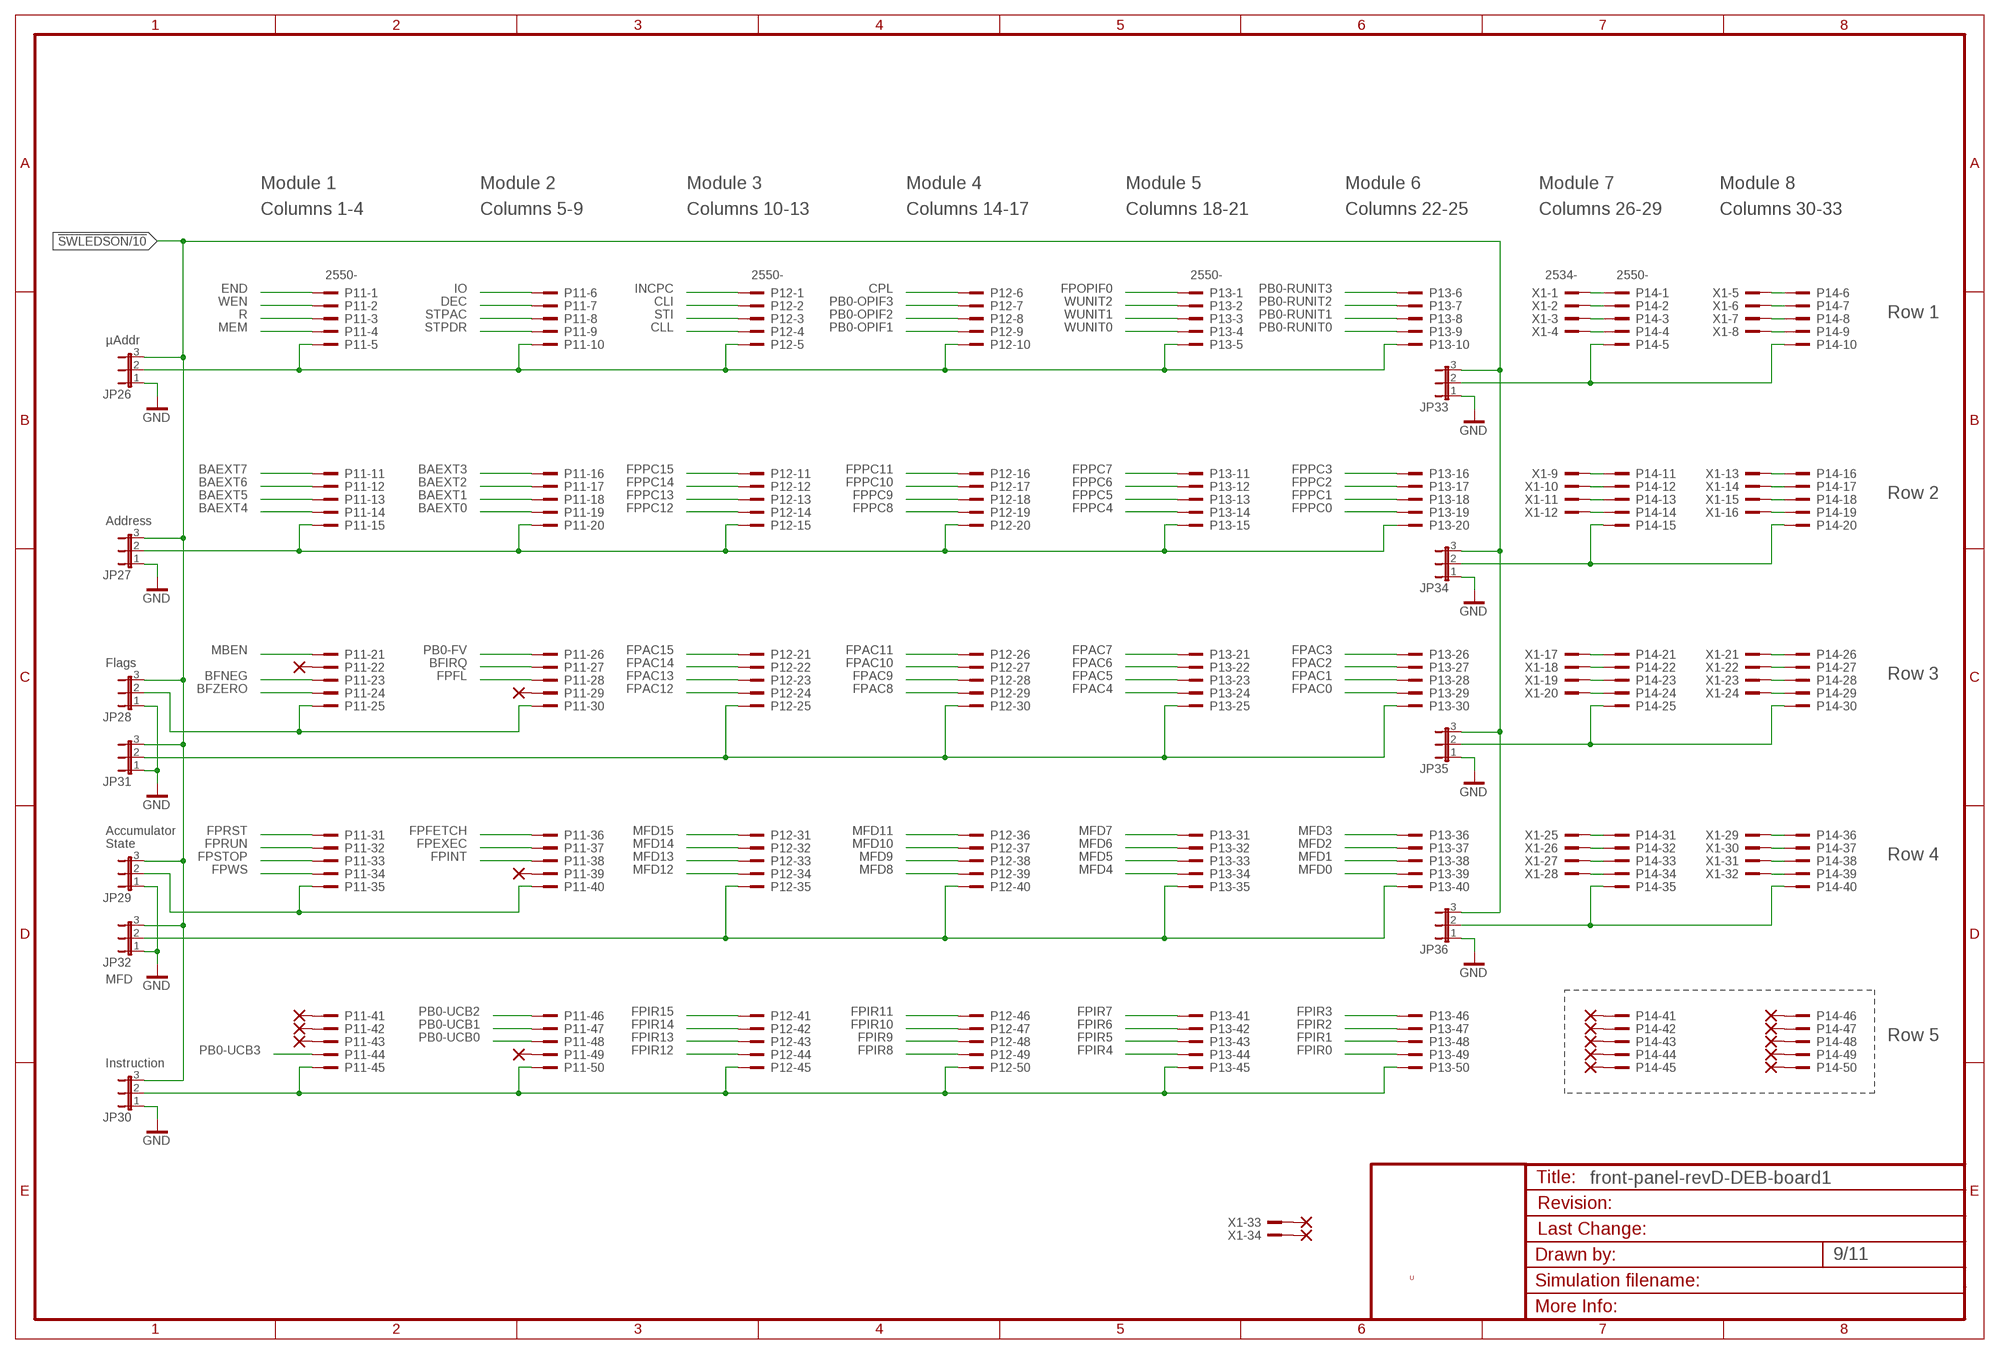
[diagram p8: schematic, sheet 9]

### Parts
JP26  JP2E  [JP2]
JP27  JP2E  [JP2]
JP28  JP2E  [JP2]
JP29  JP2E  [JP2]
JP30  JP2E  [JP2]
JP31  JP2E  [JP2]
JP32  JP2E  [JP2]
JP33  JP2E  [JP2]
JP34  JP2E  [JP2]
JP35  JP2E  [JP2]
JP36  JP2E  [JP2]
NC1  2,54/1,0  [2,54/1,0]
NC9  2,54/1,0  [2,54/1,0]
NC10  2,54/1,0  [2,54/1,0]
NC11  2,54/1,0  [2,54/1,0]
NC12  2,54/1,0  [2,54/1,0]
NC13  2,54/1,0  [2,54/1,0]
NC14  2,54/1,0  [2,54/1,0]
NC15  2,54/1,0  [2,54/1,0]
NC16  2,54/1,0  [2,54/1,0]
NC18  2,54/1,0  [2,54/1,0]
NC19  2,54/1,0  [2,54/1,0]
NC20  2,54/1,0  [2,54/1,0]
NC21  2,54/1,0  [2,54/1,0]
NC22  2,54/1,0  [2,54/1,0]
NC23  2,54/1,0  [2,54/1,0]
NC24  2,54/1,0  [2,54/1,0]
NC25  2,54/1,0  [2,54/1,0]
NC26  2,54/1,0  [2,54/1,0]
NC39  2,54/1,0  [2,54/1,0]
P11  2550-  [PAK100/2500-50]
P12  2550-  [PAK100/2500-50]
P13  2550-  [PAK100/2500-50]
P14  2550-  [PAK100/2500-50]
X1  2534-  [PAK100/2500-34]

### Nets
!SWLEDSON: JP26.3 JP27.3 JP28.3 JP29.3 JP30.3 JP31.3 JP32.3 JP33.3 JP34.3 JP35.3 JP36.3 ; also sheet 2,10
BAEXT0: P11.19 ; also sheet 10
BAEXT1: P11.18 ; also sheet 10
BAEXT2: P11.17 ; also sheet 10
BAEXT3: P11.16 ; also sheet 10
BAEXT4: P11.14 ; also sheet 10
BAEXT5: P11.13 ; also sheet 10
BAEXT6: P11.12 ; also sheet 10
BAEXT7: P11.11 ; also sheet 10
BFIRQ: P11.27 ; also sheet 5,10
BFNEG: P11.23 ; also sheet 5,10
BFZERO: P11.24 ; also sheet 5,10
CLI: P12.2 ; also sheet 5,10
CLL: P12.4 ; also sheet 5,10
CPL: P12.6 ; also sheet 5,10
DEC: P11.7 ; also sheet 5,10
END: P11.1 ; also sheet 5,10
FPAC0: P13.29 ; also sheet 5,10
FPAC1: P13.28 ; also sheet 5,10
FPAC2: P13.27 ; also sheet 5,10
FPAC3: P13.26 ; also sheet 5,10
FPAC4: P13.24 ; also sheet 5,10
FPAC5: P13.23 ; also sheet 5,10
FPAC6: P13.22 ; also sheet 5,10
FPAC7: P13.21 ; also sheet 5,10
FPAC8: P12.29 ; also sheet 5,10
FPAC9: P12.28 ; also sheet 5,10
FPAC10: P12.27 ; also sheet 5,10
FPAC11: P12.26 ; also sheet 5,10
FPAC12: P12.24 ; also sheet 5,10
FPAC13: P12.23 ; also sheet 5,10
FPAC14: P12.22 ; also sheet 5,10
FPAC15: P12.21 ; also sheet 5,10
FPEXEC: P11.37 ; also sheet 7
FPFETCH: P11.36 ; also sheet 7
FPFL: P11.28 ; also sheet 3,5,11
FPINT: P11.38 ; also sheet 10
FPIR0: P13.49 ; also sheet 5,10
FPIR1: P13.48 ; also sheet 5,10
FPIR2: P13.47 ; also sheet 5,10
FPIR3: P13.46 ; also sheet 5,10
FPIR4: P13.44 ; also sheet 5,10
FPIR5: P13.43 ; also sheet 5,10
FPIR6: P13.42 ; also sheet 5,10
FPIR7: P13.41 ; also sheet 5,10
FPIR8: P12.49 ; also sheet 5,10
FPIR9: P12.48 ; also sheet 5,10
FPIR10: P12.47 ; also sheet 5,10
FPIR11: P12.46 ; also sheet 3,5,10
FPIR12: P12.44 ; also sheet 3,5,10
FPIR13: P12.43 ; also sheet 3,5,10
FPIR14: P12.42 ; also sheet 3,5,10
FPIR15: P12.41 ; also sheet 3,5,10
FPOPIF0: P13.1 ; also sheet 5,11
FPPC0: P13.19 ; also sheet 5,10
FPPC1: P13.18 ; also sheet 5,10
FPPC2: P13.17 ; also sheet 5,10
FPPC3: P13.16 ; also sheet 5,10
FPPC4: P13.14 ; also sheet 5,10
FPPC5: P13.13 ; also sheet 5,10
FPPC6: P13.12 ; also sheet 5,10
FPPC7: P13.11 ; also sheet 5,10
FPPC8: P12.19 ; also sheet 5,10
FPPC9: P12.18 ; also sheet 5,10
FPPC10: P12.17 ; also sheet 5,10
FPPC11: P12.16 ; also sheet 5,10
FPPC12: P12.14 ; also sheet 5,10
FPPC13: P12.13 ; also sheet 5,10
FPPC14: P12.12 ; also sheet 5,10
FPPC15: P12.11 ; also sheet 5,10
FPRST: P11.31 ; also sheet 10
FPRUN: P11.32 ; also sheet 6
FPSTOP: P11.33 ; also sheet 6
FPWS: P11.34 ; also sheet 11
GND [low power]: JP26.1 JP27.1 JP28.1 JP29.1 JP30.1 JP31.1 JP32.1 JP33.1 JP34.1 JP35.1 JP36.1 ; also sheet 2,3,4,5,6,7,8,10,11
INCPC: P12.1 ; also sheet 5,10
IO: P11.6 ; also sheet 5,10
MBEN: P11.21 ; also sheet 10
MEM: P11.4 ; also sheet 5,10
MFD0: P13.39 ; also sheet 3,6
MFD1: P13.38 ; also sheet 3,6
MFD2: P13.37 ; also sheet 3,6
MFD3: P13.36 ; also sheet 3,6
MFD4: P13.34 ; also sheet 3,6
MFD5: P13.33 ; also sheet 3,6
MFD6: P13.32 ; also sheet 3,6
MFD7: P13.31 ; also sheet 3,6
MFD8: P12.39 ; also sheet 3,6
MFD9: P12.38 ; also sheet 3,6
MFD10: P12.37 ; also sheet 3,6
MFD11: P12.36 ; also sheet 3,6
MFD12: P12.34 ; also sheet 3,6
MFD13: P12.33 ; also sheet 3,6
MFD14: P12.32 ; also sheet 3,6
MFD15: P12.31 ; also sheet 3,6
N$1: NC1.1(P) P14.50
N$47: NC39.1(P) P11.49
N$82: JP26.2 P11.5 P11.10 P12.5 P12.10 P13.5 P13.10
N$93: JP27.2 P11.15 P11.20 P12.15 P12.20 P13.15 P13.20
N$94: JP33.2 P14.5 P14.10
N$95: JP34.2 P14.15 P14.20
N$96: JP35.2 P14.25 P14.30
N$97: JP31.2 P12.25 P12.30 P13.25 P13.30
N$98: JP32.2 P12.35 P12.40 P13.35 P13.40
N$99: JP30.2 P11.45 P11.50 P12.45 P12.50 P13.45 P13.50
N$100: NC9.1(P) P11.22
N$101: NC10.1(P) P11.29
N$107: NC11.1(P) P11.39
N$108: JP28.2 P11.25 P11.30
N$109: JP29.2 P11.35 P11.40
N$110: NC12.1(P) X1.33
N$111: NC13.1(P) X1.34
N$112: P14.1 X1.1
N$113: P14.2 X1.2
N$114: P14.3 X1.3
N$118: P14.4 X1.4
N$126: P14.11 X1.9
N$127: P14.12 X1.10
N$128: P14.13 X1.11
N$129: P14.14 X1.12
N$130: P14.21 X1.17
N$131: P14.22 X1.18
N$132: P14.23 X1.19
N$133: P14.24 X1.20
N$134: P14.6 X1.5
N$135: P14.7 X1.6
N$136: P14.8 X1.7
N$137: P14.9 X1.8
N$138: P14.16 X1.13
N$139: P14.17 X1.14
N$141: P14.18 X1.15
N$142: P14.19 X1.16
N$143: P14.26 X1.21
N$144: P14.27 X1.22
N$147: P14.28 X1.23
N$154: P14.29 X1.24
N$158: JP36.2 P14.35 P14.40
N$174: P14.31 X1.25
N$180: P14.32 X1.26
N$181: P14.33 X1.27
N$182: P14.34 X1.28
N$183: P14.36 X1.29
N$184: P14.37 X1.30
N$185: P14.38 X1.31
N$186: P14.39 X1.32
N$187: NC14.1(P) P11.41
N$188: NC15.1(P) P11.42
N$189: NC16.1(P) P11.43
N$191: NC18.1(P) P14.41
N$192: NC19.1(P) P14.42
N$193: NC20.1(P) P14.43
N$194: NC21.1(P) P14.44
N$195: NC22.1(P) P14.45
N$196: NC23.1(P) P14.46
N$197: NC24.1(P) P14.47
N$198: NC25.1(P) P14.48
N$199: NC26.1(P) P14.49
PB0-FV: P11.26 ; also sheet 3,5,10
PB0-OPIF1: P12.9 ; also sheet 5,10
PB0-OPIF2: P12.8 ; also sheet 5,10
PB0-OPIF3: P12.7 ; also sheet 5,10
PB0-RUNIT0: P13.9 ; also sheet 5,10
PB0-RUNIT1: P13.8 ; also sheet 5,10
PB0-RUNIT2: P13.7 ; also sheet 5,10
PB0-RUNIT3: P13.6 ; also sheet 5,10
PB0-UCB0: P11.48 ; also sheet 10
PB0-UCB1: P11.47 ; also sheet 10
PB0-UCB2: P11.46 ; also sheet 10
PB0-UCB3: P11.44 ; also sheet 10
R: P11.3 ; also sheet 10
STI: P12.3 ; also sheet 5,10
STPAC: P11.8 ; also sheet 5,10
STPDR: P11.9 ; also sheet 5,10
WEN: P11.2 ; also sheet 10
WUNIT0: P13.4 ; also sheet 5,10
WUNIT1: P13.3 ; also sheet 5,10
WUNIT2: P13.2 ; also sheet 5,10

### Notes on the sheet
- Module 1 | Module 2 | Module 3 | Module 4 | Module 5 | Module 6 | Module 7 | Module 8
- Columns 1-4 | Columns 5-9 | Columns 10-13 | Columns 14-17 | Columns 18-21 | Columns 22-25 | Columns 26-29 | Columns 30-33
- Row 1
- µAddr
- Row 2
- Address
- Flags
- Row 3
- Accumulator
- State
- Row 4
- MFD
- Row 5
- Instruction
- U

## Sheet 10 of 11
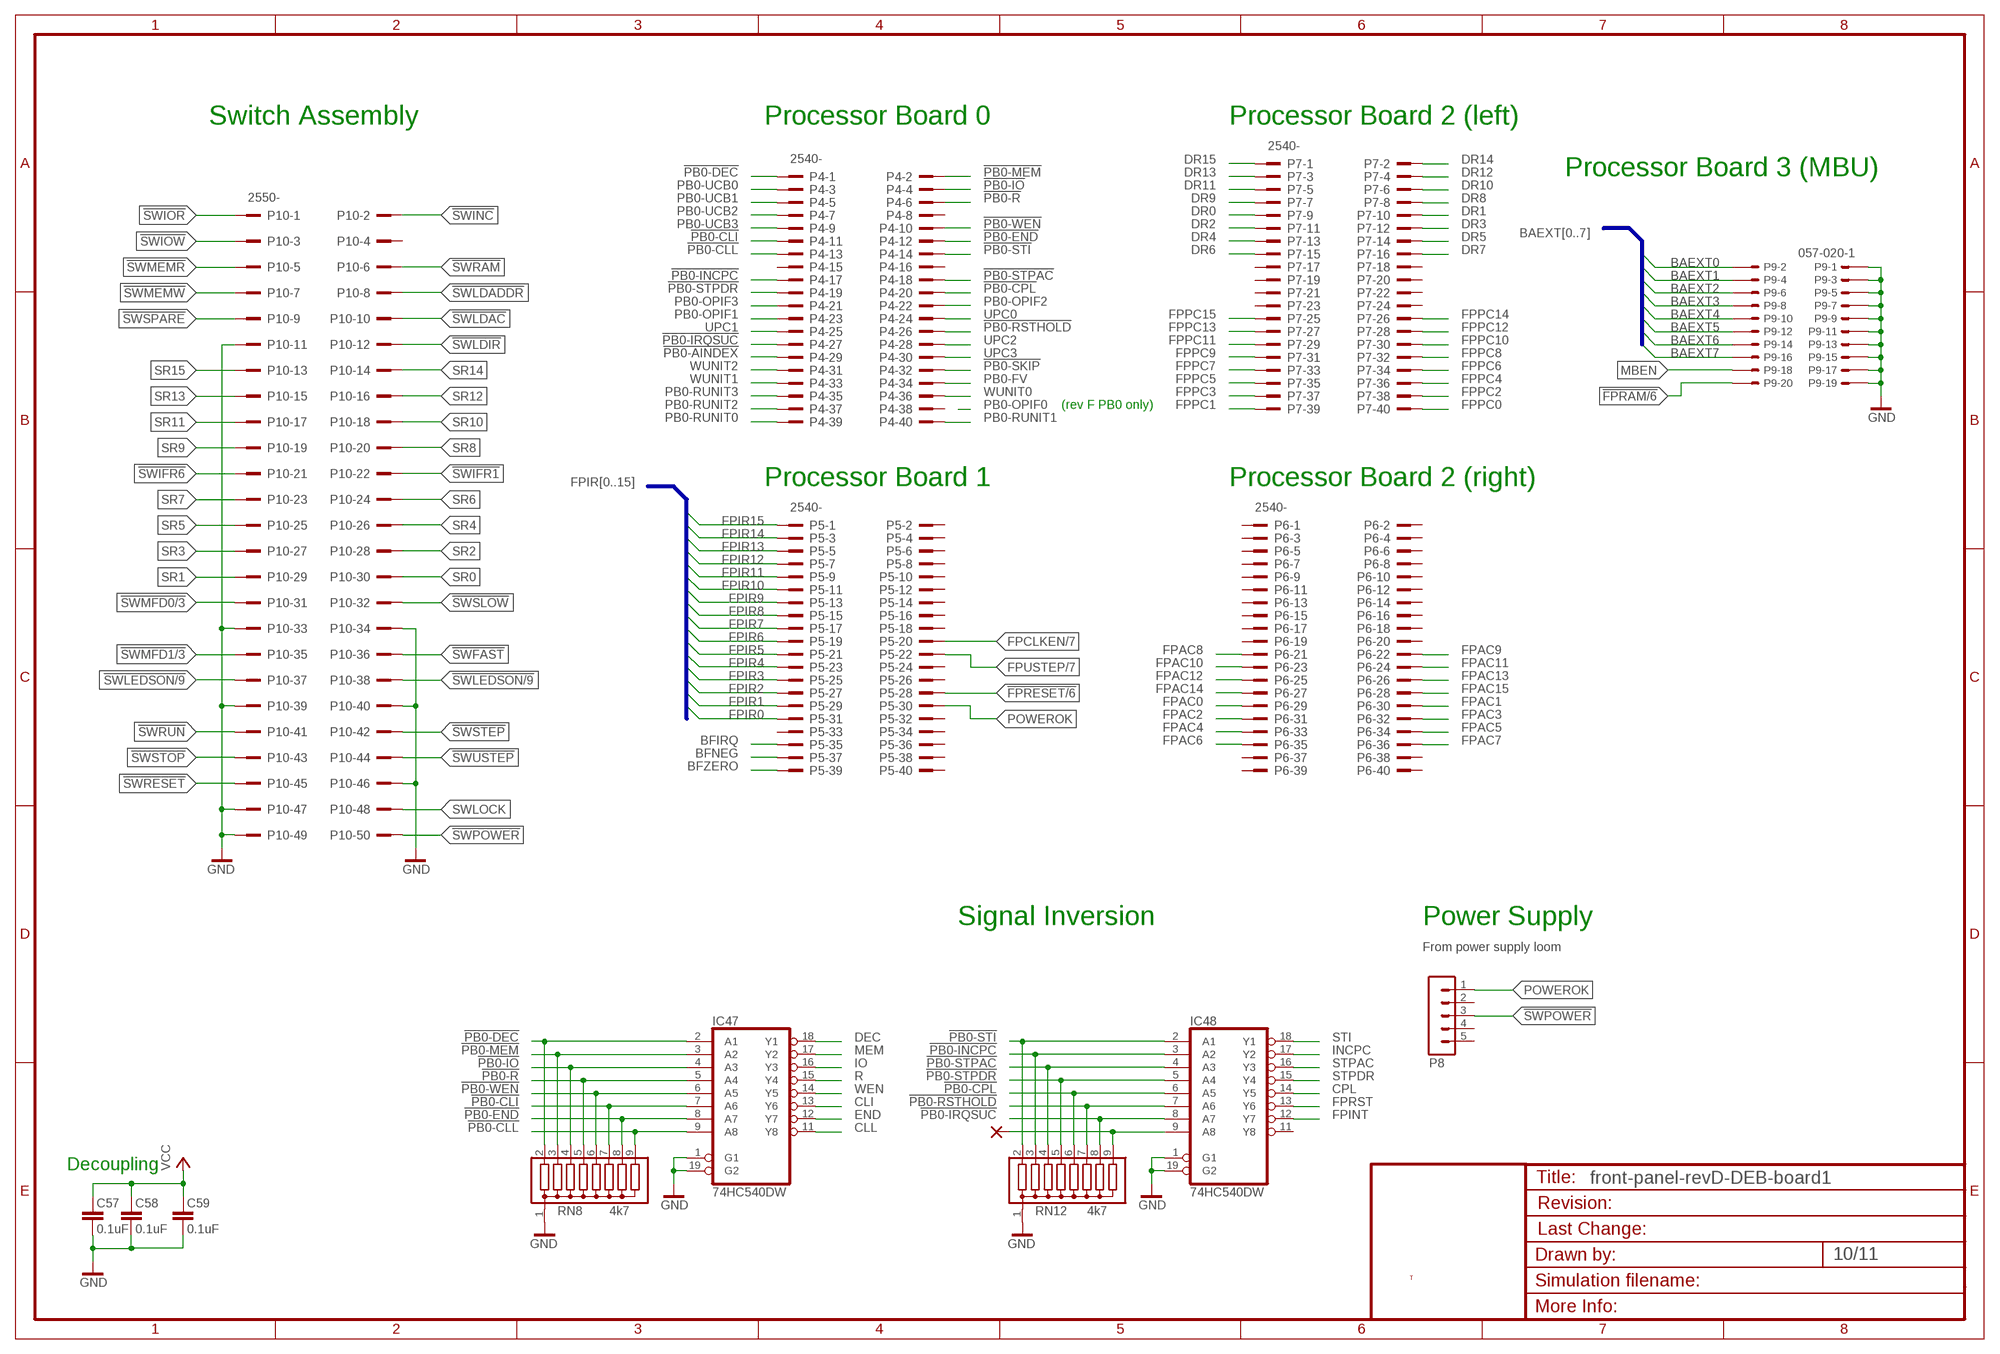
[diagram p9: schematic, sheet 10]

### Parts
C57  0.1uF  C-EU025-024X044  [C025-024X044]
C58  0.1uF  C-EU025-024X044  [C025-024X044]
C59  0.1uF  C-EU025-024X044  [C025-024X044]
IC47  74HC540DW  [SO20W]
IC48  74HC540DW  [SO20W]
NC3  2,54/1,0  [2,54/1,0]
P4  2540-  [PAK100/2500-40]
P5  2540-  [PAK100/2500-40]
P6  2540-  [PAK100/2500-40]
P7  2540-  [PAK100/2500-40]
P8  MA05-1  [MA05-1]
P9  057-020-1  [057-020-1]
P10  2550-  [PAK100/2500-50]
RN8  4k7  G08R  [SIL9]
RN12  4k7  G08R  [SIL9]

### Nets
!FPRAM: P9.20 ; also sheet 6
!FPRESET: P5.28 ; also sheet 6
!PB0-AINDEX: P4.29 ; also sheet 3
!PB0-CLI: IC47.7(A6) P4.11 RN8.7
!PB0-CLL: IC47.9(A8) P4.13 RN8.9
!PB0-CPL: IC48.6(A5) P4.20 RN12.6
!PB0-DEC: IC47.2(A1) P4.1 RN8.2
!PB0-END: IC47.8(A7) P4.12 RN8.8
!PB0-INCPC: IC48.3(A2) P4.17 RN12.3
!PB0-IO: IC47.4(A3) P4.4 RN8.4
!PB0-IRQSUC: IC48.8(A7) P4.27 RN12.8 ; also sheet 3
!PB0-MEM: IC47.3(A2) P4.2 RN8.3
!PB0-R: IC47.5(A4) P4.6 RN8.5
!PB0-RSTHOLD: IC48.7(A6) P4.26 RN12.7 ; also sheet 3
!PB0-SKIP: P4.32 ; also sheet 3
!PB0-STI: IC48.2(A1) P4.14 RN12.2
!PB0-STPAC: IC48.4(A3) P4.18 RN12.4
!PB0-STPDR: IC48.5(A4) P4.19 RN12.5
!PB0-WEN: IC47.6(A5) P4.10 RN8.6
!SWFAST: P10.36 ; also sheet 2,4
!SWIFR1: P10.22 ; also sheet 2,4
!SWIFR6: P10.21 ; also sheet 2,4
!SWINC: P10.2 ; also sheet 2,4
!SWIOR: P10.1 ; also sheet 2,4
!SWIOW: P10.3 ; also sheet 2,4
!SWLDAC: P10.10 ; also sheet 2,4
!SWLDADDR: P10.8 ; also sheet 2,4
!SWLDIR: P10.12 ; also sheet 2,4
!SWLEDSON: P10.37 P10.38 ; also sheet 2,9
!SWMEMR: P10.5 ; also sheet 2,4
!SWMEMW: P10.7 ; also sheet 2,4
!SWMFD0: P10.31 ; also sheet 2,3
!SWMFD1: P10.35 ; also sheet 2,3
!SWPOWER: P8.3 P10.50 ; also sheet 2
!SWRAM: P10.6 ; also sheet 2,4
!SWRESET: P10.45 ; also sheet 2,4
!SWRUN: P10.41 ; also sheet 2,4
!SWSLOW: P10.32 ; also sheet 2,4
!SWSPARE: P10.9 ; also sheet 2,4
!SWSTEP: P10.42 ; also sheet 2,4
!SWSTOP: P10.43 ; also sheet 2,4
!SWUSTEP: P10.44 ; also sheet 2,4
BAEXT0: P9.2 ; also sheet 9
BAEXT1: P9.4 ; also sheet 9
BAEXT2: P9.6 ; also sheet 9
BAEXT3: P9.8 ; also sheet 9
BAEXT4: P9.10 ; also sheet 9
BAEXT5: P9.12 ; also sheet 9
BAEXT6: P9.14 ; also sheet 9
BAEXT7: P9.16 ; also sheet 9
BFIRQ: P5.35 ; also sheet 5,9
BFNEG: P5.37 ; also sheet 5,9
BFZERO: P5.39 ; also sheet 5,9
CLI: IC47.13(Y6) ; also sheet 5,9
CLL: IC47.11(Y8) ; also sheet 5,9
CPL: IC48.14(Y5) ; also sheet 5,9
DEC: IC47.18(Y1) ; also sheet 5,9
DR0: P7.9 ; also sheet 3
DR1: P7.10 ; also sheet 3
DR2: P7.11 ; also sheet 3
DR3: P7.12 ; also sheet 3
DR4: P7.13 ; also sheet 3
DR5: P7.14 ; also sheet 3
DR6: P7.15 ; also sheet 3
DR7: P7.16 ; also sheet 3
DR8: P7.8 ; also sheet 3
DR9: P7.7 ; also sheet 3
DR10: P7.6 ; also sheet 3
DR11: P7.5 ; also sheet 3
DR12: P7.4 ; also sheet 3
DR13: P7.3 ; also sheet 3
DR14: P7.2 ; also sheet 3
DR15: P7.1 ; also sheet 3
END: IC47.12(Y7) ; also sheet 5,9
FPAC0: P6.29 ; also sheet 5,9
FPAC1: P6.30 ; also sheet 5,9
FPAC2: P6.31 ; also sheet 5,9
FPAC3: P6.32 ; also sheet 5,9
FPAC4: P6.33 ; also sheet 5,9
FPAC5: P6.34 ; also sheet 5,9
FPAC6: P6.35 ; also sheet 5,9
FPAC7: P6.36 ; also sheet 5,9
FPAC8: P6.21 ; also sheet 5,9
FPAC9: P6.22 ; also sheet 5,9
FPAC10: P6.23 ; also sheet 5,9
FPAC11: P6.24 ; also sheet 5,9
FPAC12: P6.25 ; also sheet 5,9
FPAC13: P6.26 ; also sheet 5,9
FPAC14: P6.27 ; also sheet 5,9
FPAC15: P6.28 ; also sheet 5,9
FPCLKEN: P5.20 ; also sheet 7
FPINT: IC48.12(Y7) ; also sheet 9
FPIR0: P5.31 ; also sheet 5,9
FPIR1: P5.29 ; also sheet 5,9
FPIR2: P5.27 ; also sheet 5,9
FPIR3: P5.25 ; also sheet 5,9
FPIR4: P5.23 ; also sheet 5,9
FPIR5: P5.21 ; also sheet 5,9
FPIR6: P5.19 ; also sheet 5,9
FPIR7: P5.17 ; also sheet 5,9
FPIR8: P5.15 ; also sheet 5,9
FPIR9: P5.13 ; also sheet 5,9
FPIR10: P5.11 ; also sheet 5,9
FPIR11: P5.9 ; also sheet 3,5,9
FPIR12: P5.7 ; also sheet 3,5,9
FPIR13: P5.5 ; also sheet 3,5,9
FPIR14: P5.3 ; also sheet 3,5,9
FPIR15: P5.1 ; also sheet 3,5,9
FPPC0: P7.40 ; also sheet 5,9
FPPC1: P7.39 ; also sheet 5,9
FPPC2: P7.38 ; also sheet 5,9
FPPC3: P7.37 ; also sheet 5,9
FPPC4: P7.36 ; also sheet 5,9
FPPC5: P7.35 ; also sheet 5,9
FPPC6: P7.34 ; also sheet 5,9
FPPC7: P7.33 ; also sheet 5,9
FPPC8: P7.32 ; also sheet 5,9
FPPC9: P7.31 ; also sheet 5,9
FPPC10: P7.30 ; also sheet 5,9
FPPC11: P7.29 ; also sheet 5,9
FPPC12: P7.28 ; also sheet 5,9
FPPC13: P7.27 ; also sheet 5,9
FPPC14: P7.26 ; also sheet 5,9
FPPC15: P7.25 ; also sheet 5,9
FPRST: IC48.13(Y6) ; also sheet 9
FPUSTEP: P5.22 ; also sheet 7
GND [low power]: C57.1 C58.1 C59.1 IC47.1(G1) IC47.19(G2) IC48.1(G1) IC48.19(G2) P9.1 P9.3 P9.5 P9.7 P9.9 P9.11 P9.13 P9.15 P9.17 P9.19 P10.11 P10.33 P10.34 P10.39 P10.40 P10.46 P10.47 P10.49 RN8.1 RN12.1 ; also sheet 2,3,4,5,6,7,8,9,11
INCPC: IC48.17(Y2) ; also sheet 5,9
IO: IC47.16(Y3) ; also sheet 5,9
MBEN: P9.18 ; also sheet 9
MEM: IC47.17(Y2) ; also sheet 5,9
N$31 [low power]: IC48.9(A8) NC3.1(P) RN12.9
PB0-FV: P4.34 ; also sheet 3,5,9
PB0-OPIF1: P4.23 ; also sheet 5,9
PB0-OPIF2: P4.22 ; also sheet 5,9
PB0-OPIF3: P4.21 ; also sheet 5,9
PB0-RUNIT0: P4.39 ; also sheet 5,9
PB0-RUNIT1: P4.40 ; also sheet 5,9
PB0-RUNIT2: P4.37 ; also sheet 5,9
PB0-RUNIT3: P4.35 ; also sheet 5,9
PB0-UCB0: P4.3 ; also sheet 9
PB0-UCB1: P4.5 ; also sheet 9
PB0-UCB2: P4.7 ; also sheet 9
PB0-UCB3: P4.9 ; also sheet 9
POWEROK: P5.30 P8.1
R: IC47.15(Y4) ; also sheet 9
SR0: P10.30 ; also sheet 2,4
SR1: P10.29 ; also sheet 2,4
SR2: P10.28 ; also sheet 2,4
SR3: P10.27 ; also sheet 2,4
SR4: P10.26 ; also sheet 2,4
SR5: P10.25 ; also sheet 2,4
SR6: P10.24 ; also sheet 2,4
SR7: P10.23 ; also sheet 2,4
SR8: P10.20 ; also sheet 2,4
SR9: P10.19 ; also sheet 2,4
SR10: P10.18 ; also sheet 2,4
SR11: P10.17 ; also sheet 2,4
SR12: P10.16 ; also sheet 2,4
SR13: P10.15 ; also sheet 2,4
SR14: P10.14 ; also sheet 2,4
SR15: P10.13 ; also sheet 2,4
STI: IC48.18(Y1) ; also sheet 5,9
STPAC: IC48.16(Y3) ; also sheet 5,9
STPDR: IC48.15(Y4) ; also sheet 5,9
SWLOCK: P10.48 ; also sheet 2,4
UPC0: P4.24 ; also sheet 3,7
UPC1: P4.25 ; also sheet 3,7
UPC2: P4.28 ; also sheet 3,7
UPC3: P4.30 ; also sheet 3,7
VCC [low power]: C57.2 C58.2 C59.2 ; also sheet 3,4,5,6,7,8,11
WEN: IC47.14(Y5) ; also sheet 9
WUNIT0: P4.36 ; also sheet 5,9
WUNIT1: P4.33 ; also sheet 5,9
WUNIT2: P4.31 ; also sheet 5,9
Unconnected: IC48.11(Y8) P4.8 P4.15 P4.16 P4.38 P5.2 P5.4 P5.6 P5.8 P5.10 P5.12 P5.14 P5.16 P5.18 P5.24 P5.26 P5.32 P5.33 P5.34 P5.36 P5.38 P5.40 P6.1 P6.2 P6.3 P6.4 P6.5 P6.6 P6.7 P6.8 P6.9 P6.10 P6.11 P6.12 P6.13 P6.14 P6.15 P6.16 P6.17 P6.18 P6.19 P6.20 P6.37 P6.38 P6.39 P6.40 P7.17 P7.18 P7.19 P7.20 P7.21 P7.22 P7.23 P7.24 P8.2 P8.4 P8.5 P10.4

### Buses
BAEXT[0..7]
FPIR[0..15]

### Notes on the sheet
- Switch Assembly | Processor Board 0 | Processor Board 2 (left)
- Processor Board 3 (MBU)
- (rev F PB0 only)
- Processor Board 1 | Processor Board 2 (right)
- Signal Inversion | Power Supply
- From power supply loom
- Decoupling
- T